# EAGLE design gen6.d (EAGLE 5.10)
PARTNO: *
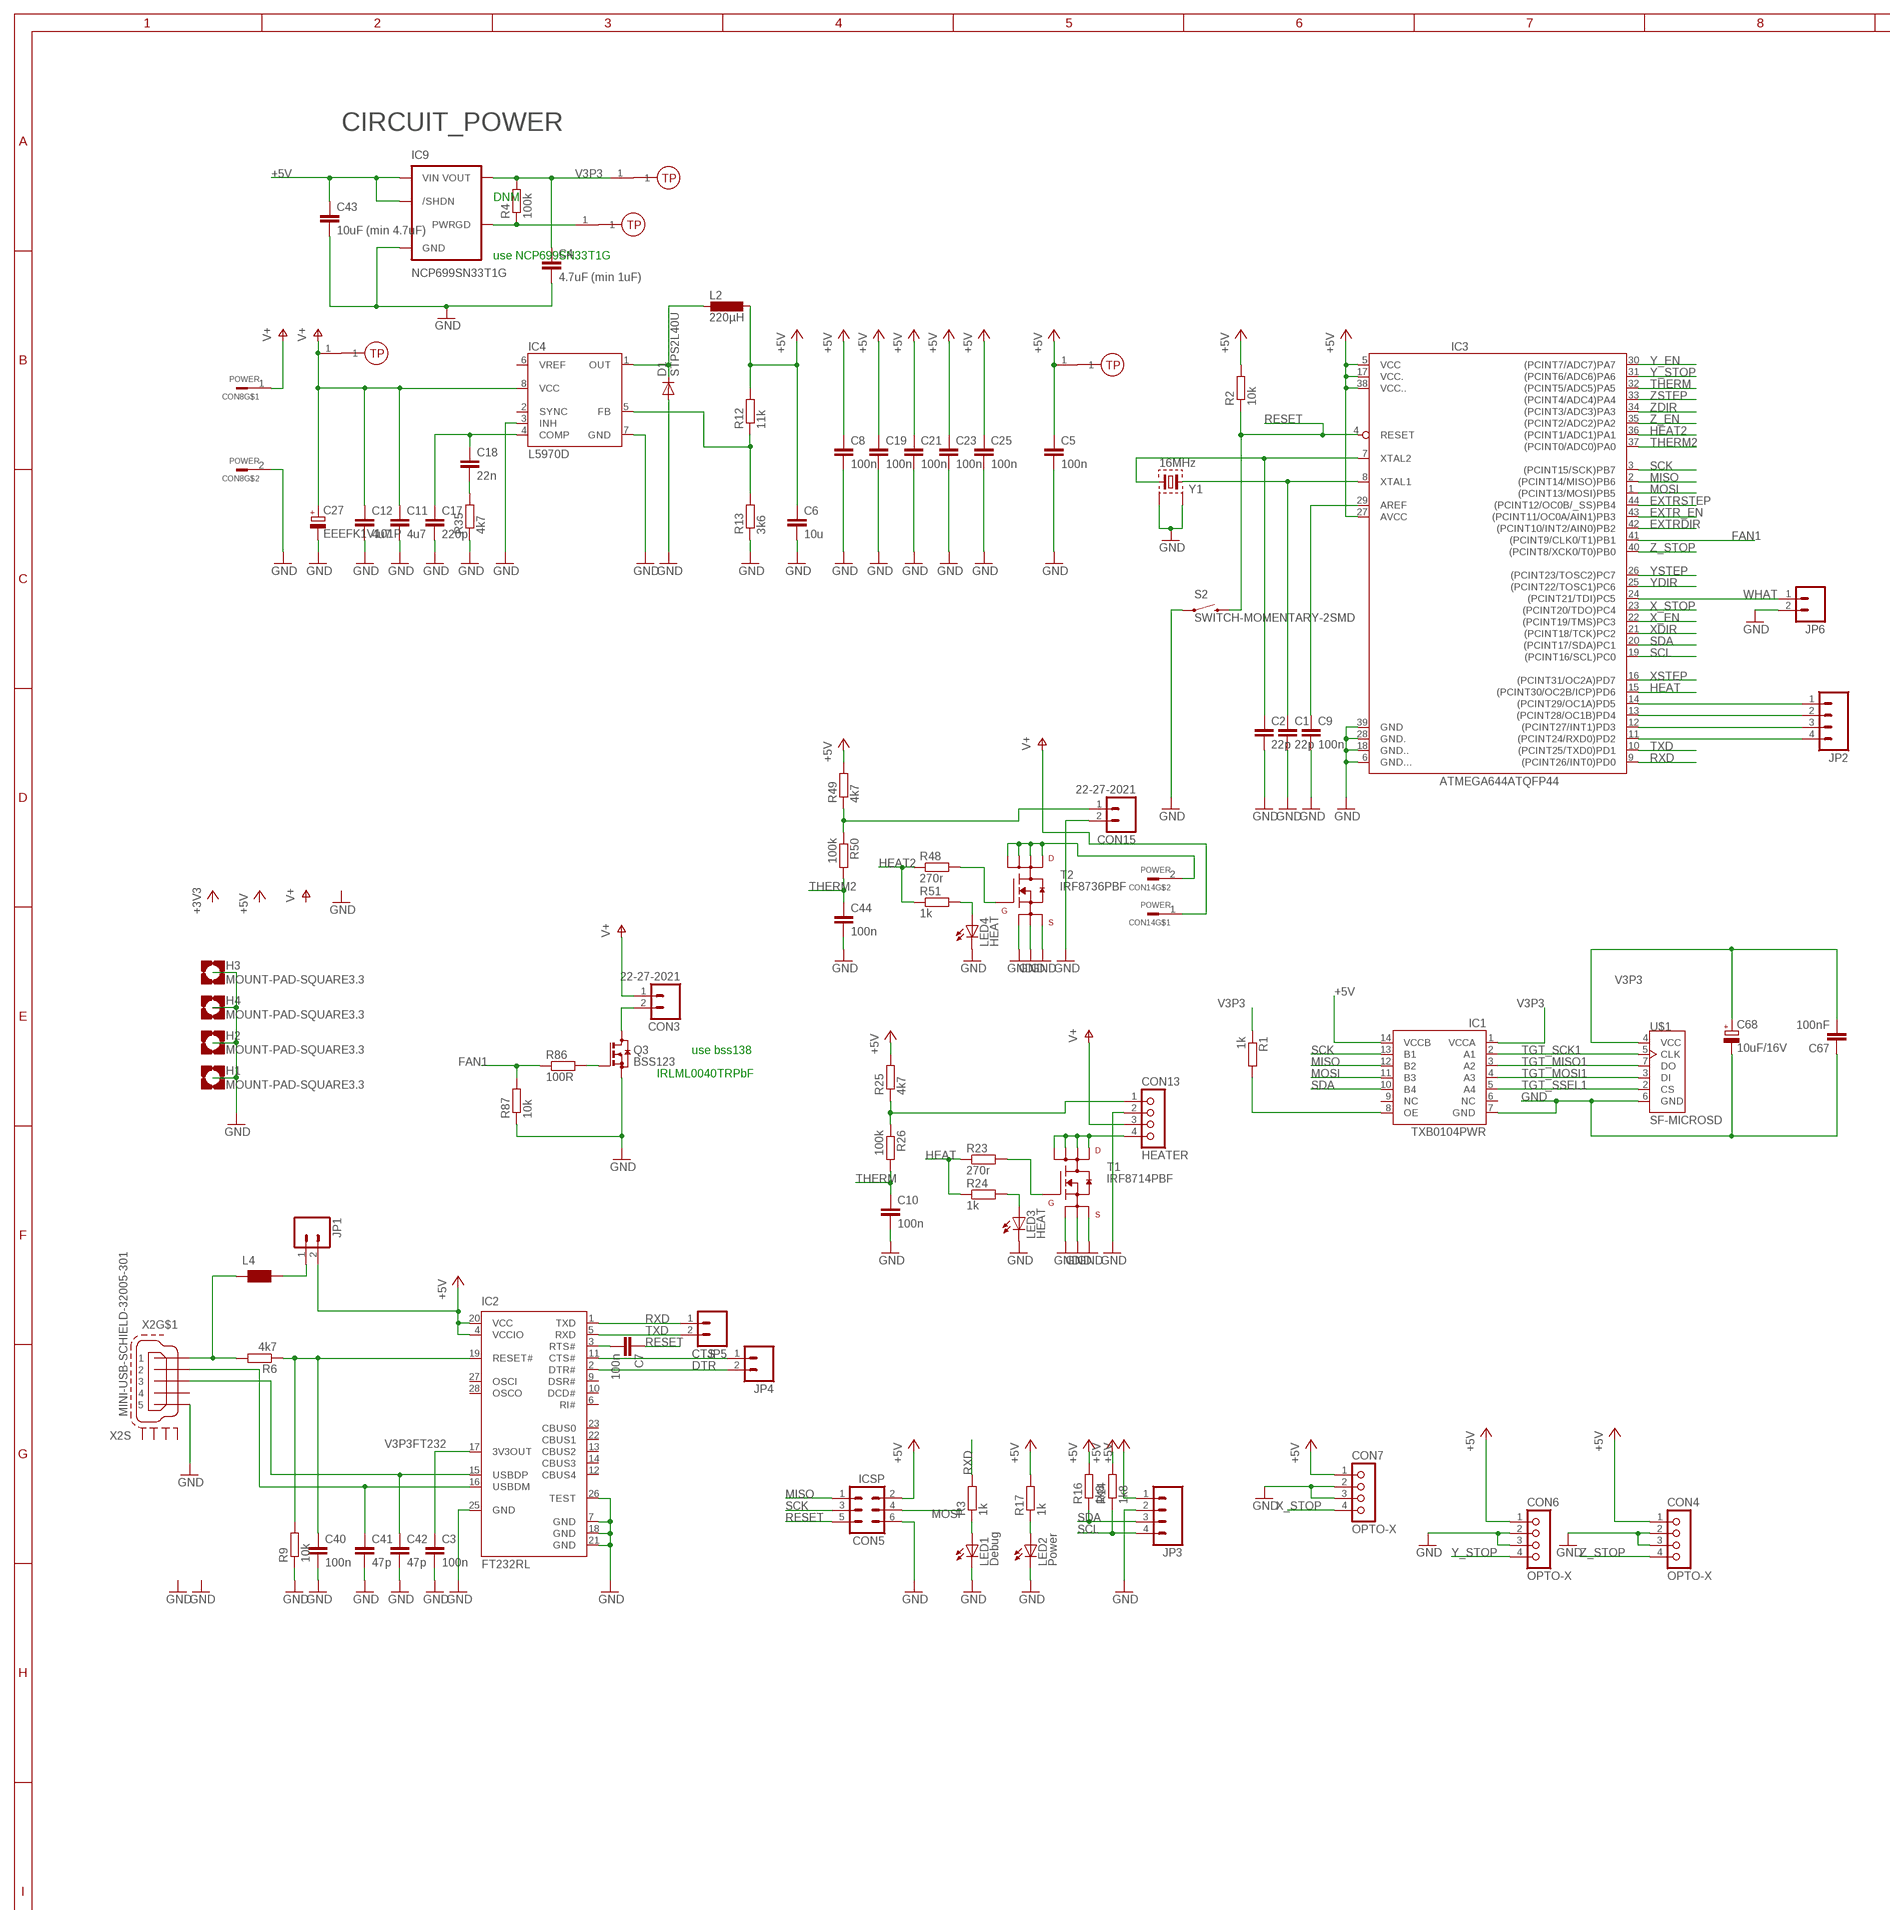
[diagram p0: schematic, sheet 1, part 1 of 2]
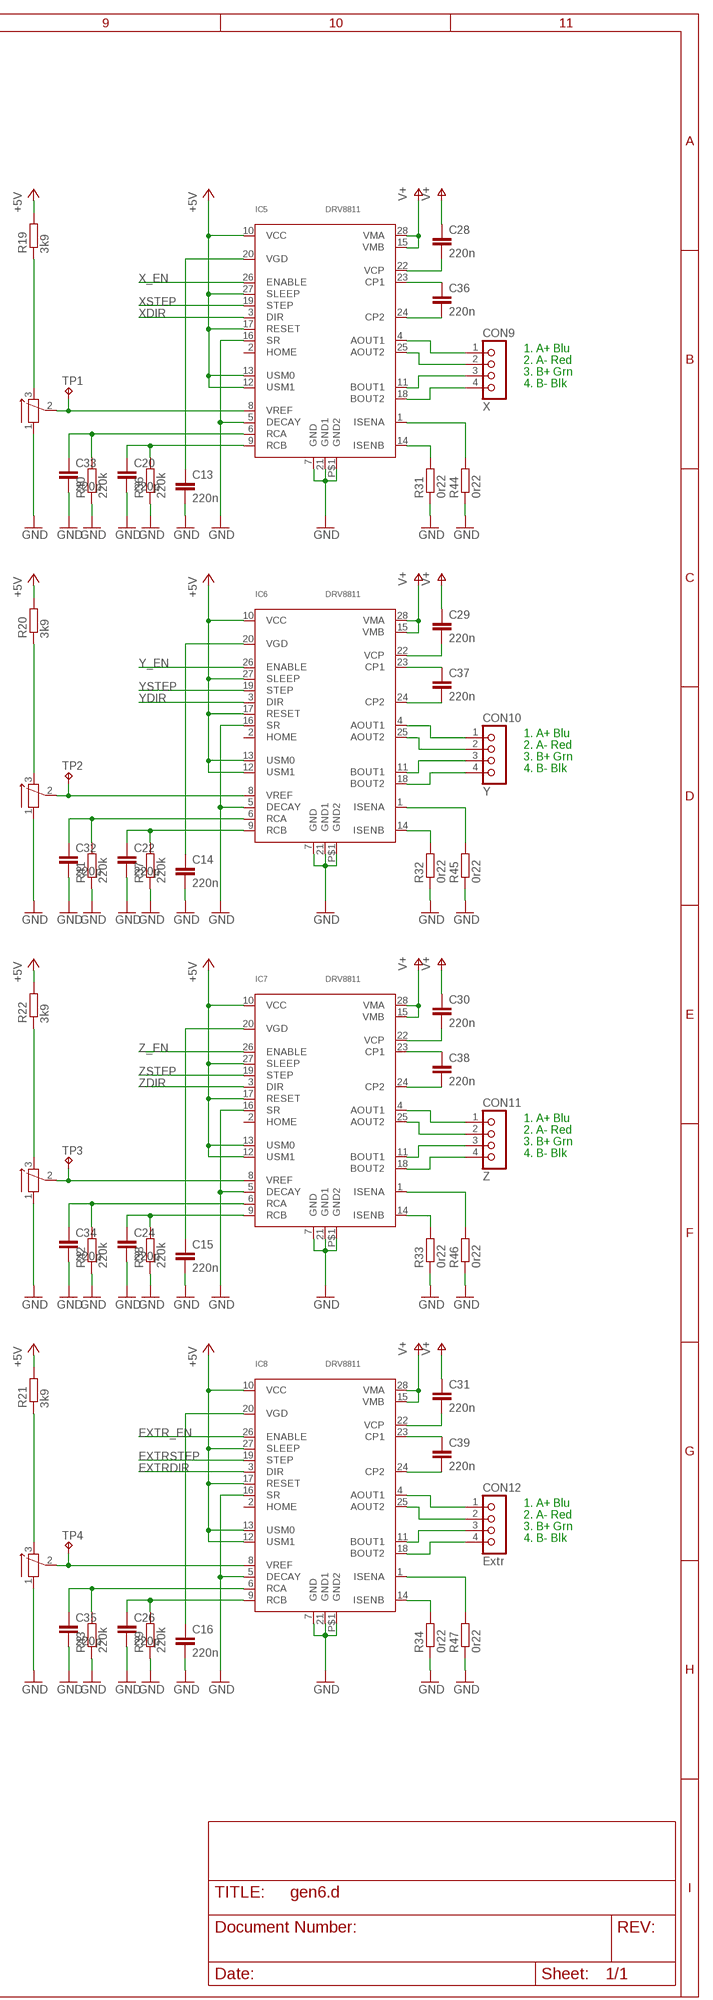
[diagram p1: schematic, sheet 1, part 2 of 2]

## Parts
C1  22p  C-EUC0603  [C0603]
C2  22p  C-EUC0603  [C0603]
C3  100n  C-EUC0603  [C0603]
C4  4.7uF (min 1uF)  C-EUC0805LG  [C0805_LONGER]
C5  100n  C-EUC0603  [C0603]
C6  10u  C-EUC1206  [C1206]
C7  100n  C-EUC0603  [C0603]
C8  100n  C-EUC0603  [C0603]
C9  100n  C-EUC0603  [C0603]
C10  100n  C-EUC0603  [C0603]
C11  4u7  C-EUC1206  [C1206]
C12  4u7  C-EUC1206  [C1206]
C13  220n  C-EUC1206  [C1206]
C14  220n  C-EUC1206  [C1206]
C15  220n  C-EUC1206  [C1206]
C16  220n  C-EUC1206  [C1206]
C17  220p  C-EUC0603  [C0603]
C18  22n  C-EUC0603  [C0603]
C19  100n  C-EUC0603  [C0603]
C20  220p  C-EUC0603  [C0603]
C21  100n  C-EUC0603  [C0603]
C22  220p  C-EUC0603  [C0603]
C23  100n  C-EUC0603  [C0603]
C24  220p  C-EUC0603  [C0603]
C25  100n  C-EUC0603  [C0603]
C26  220p  C-EUC0603  [C0603]
C27  EEEFK1V101P  CPOL-EUF  [PANASONIC_F]
C28  220n  C-EUC1206  [C1206]
C29  220n  C-EUC1206  [C1206]
C30  220n  C-EUC1206  [C1206]
C31  220n  C-EUC1206  [C1206]
C32  220p  C-EUC0603  [C0603]
C33  220p  C-EUC0603  [C0603]
C34  220p  C-EUC0603  [C0603]
C35  220p  C-EUC0603  [C0603]
C36  220n  C-EUC1206  [C1206]
C37  220n  C-EUC1206  [C1206]
C38  220n  C-EUC1206  [C1206]
C39  220n  C-EUC1206  [C1206]
C40  100n  C-EUC0603  [C0603]
C41  47p  C-EUC0603  [C0603]
C42  47p  C-EUC0603  [C0603]
C43  10uF (min 4.7uF)  C-EUC0805LG  [C0805_LONGER]
C44  100n  C-EUC0603  [C0603]
C67  100nF  C-EUC0603  [C0603]
C68  10uF/16V  CPOL-EUCT3216  [CT3216]
CON3  22-27-2021  M02POLAR  [MOLEX-1X2]
CON4  OPTO-X  61900411121  [61900411121]
CON5  ICSP  MA03-2  [MA03-2]
CON6  OPTO-X  61900411121  [61900411121]
CON7  OPTO-X  61900411121  [61900411121]
CON8  POWER  WEIDMULLERSL2  [WEIDMULLERSL2]
CON9  X  61900411121  [61900411121]
CON10  Y  61900411121  [61900411121]
CON11  Z  61900411121  [61900411121]
CON12  Extr  61900411121  [61900411121]
CON13  HEATER  61900411121  [61900411121]
CON14  POWER  WEIDMULLERSL2  [WEIDMULLERSL2]
CON15  22-27-2021  M02POLAR  [MOLEX-1X2]
D1  STPS2L40U  DIODE-SMB  [SMB]
H1  MOUNT-PAD-SQUARE3.3  [3,3-PAD-SQUARE]
H2  MOUNT-PAD-SQUARE3.3  [3,3-PAD-SQUARE]
H3  MOUNT-PAD-SQUARE3.3  [3,3-PAD-SQUARE]
H4  MOUNT-PAD-SQUARE3.3  [3,3-PAD-SQUARE]
IC1  TXB0104PWR  TXB104PWR  [TSSOP(PW)-14]
IC2  FT232RL  [SSOP28]
IC3  ATMEGA644ATQFP44  [TQFP44]
IC4  L5970D  [SO-08]
IC5  DRV8811  [HTSSOP28]
IC6  DRV8811  [HTSSOP28]
IC7  DRV8811  [HTSSOP28]
IC8  DRV8811  [HTSSOP28]
IC9  NCP699SN33T1G  MCP1824T-1802EOT  [SOT23-5]
JP1  M02PTH  [1X02]
JP2  M04PTH  [1X04]
JP3  M04PTH  [1X04]
JP4  M02PTH  [1X02]
JP5  M02PTH  [1X02]
JP6  M02PTH  [1X02]
L2  220µH  DO3316P  [DO3316P]
L4  WE-CBF_1210  [1210]
LED1  Debug  LEDCHIP-LED0805  [CHIP-LED0805]
LED2  Power  LEDCHIP-LED0805  [CHIP-LED0805]
LED3  HEAT  LEDCHIP-LED0805  [CHIP-LED0805]
LED4  HEAT  LEDCHIP-LED0805  [CHIP-LED0805]
Q3  BSS123  [SOT23]
R1  1k  R-EU_R0603  [R0603]
R2  10k  R-EU_R0603  [R0603]
R3  1k  R-EU_R0603  [R0603]
R4  100k  R-EU_R0603  [R0603]
R6  4k7  R-EU_R0603  [R0603]
R9  10k  R-EU_R0603  [R0603]
R12  11k  R-EU_R0603  [R0603]
R13  3k6  R-EU_R0603  [R0603]
R14  1k8  R-EU_R0603  [R0603]
R16  1k8  R-EU_R0603  [R0603]
R17  1k  R-EU_R0603  [R0603]
R19  3k9  R-EU_R0603  [R0603]
R20  3k9  R-EU_R0603  [R0603]
R21  3k9  R-EU_R0603  [R0603]
R22  3k9  R-EU_R0603  [R0603]
R23  270r  R-EU_R0603  [R0603]
R24  1k  R-EU_R0603  [R0603]
R25  4k7  R-EU_R0603  [R0603]
R26  100k  R-EU_R0603  [R0603]
R27  10k  3314G-1  [3314G-1]
R28  10k  3314G-1  [3314G-1]
R29  10k  3314G-1  [3314G-1]
R30  10k  3314G-1  [3314G-1]
R31  0r22  R-EU_R1210  [R1210]
R32  0r22  R-EU_R1210  [R1210]
R33  0r22  R-EU_R1210  [R1210]
R34  0r22  R-EU_R1210  [R1210]
R35  4k7  R-EU_R0603  [R0603]
R36  220k  R-EU_R0603  [R0603]
R37  220k  R-EU_R0603  [R0603]
R38  220k  R-EU_R0603  [R0603]
R39  220k  R-EU_R0603  [R0603]
R40  220k  R-EU_R0603  [R0603]
R41  220k  R-EU_R0603  [R0603]
R42  220k  R-EU_R0603  [R0603]
R43  220k  R-EU_R0603  [R0603]
R44  0r22  R-EU_R1210  [R1210]
R45  0r22  R-EU_R1210  [R1210]
R46  0r22  R-EU_R1210  [R1210]
R47  0r22  R-EU_R1210  [R1210]
R48  270r  R-EU_R0603  [R0603]
R49  4k7  R-EU_R0603  [R0603]
R50  100k  R-EU_R0603  [R0603]
R51  1k  R-EU_R0603  [R0603]
R86  100R  R-EU_R0603  [R0603]
R87  10k  R-EU_R0603  [R0603]
S2  SWITCH-MOMENTARY-2SMD  [TACTILE_SWITCH_SMD]
T1  IRF8714PBF  MOSFET_N_SO8  [SO-08]
T2  IRF8736PBF  MOSFET_N_SO8  [SO-08]
TP1  TPB1,27  [B1,27]
TP2  TPB1,27  [B1,27]
TP3  TPB1,27  [B1,27]
TP4  TPB1,27  [B1,27]
TP5  TP_1  [TP_1]
TP6  TP_1  [TP_1]
TP7  TP_1  [TP_1]
TP8  TP_1  [TP_1]
U$1  SF-MICROSD  [MICROSD]
X2  MINI-USB-SCHIELD-32005-301  [32005-301]
Y1  16MHz  ABM3B  [ABM3B]

## Nets
+5V: C5.1 C6.1 C8.1 C19.1 C21.1 C23.1 C25.1 C43.1 CON4.1 CON5.2 CON6.1 CON7.1 IC1.14(VCCB) IC2.4(VCCIO) IC2.20(VCC) IC3.5(VCC) IC3.17(VCC.) IC3.27(AVCC) IC3.38(VCC..) IC5.10(VCC) IC5.12(USM1) IC5.13(USM0) IC5.17(RESET) IC5.27(SLEEP) IC6.10(VCC) IC6.12(USM1) IC6.13(USM0) IC6.17(RESET) IC6.27(SLEEP) IC7.10(VCC) IC7.12(USM1) IC7.13(USM0) IC7.17(RESET) IC7.27(SLEEP) IC8.10(VCC) IC8.12(USM1) IC8.13(USM0) IC8.17(RESET) IC8.27(SLEEP) IC9.1(VIN) IC9.3(/SHDN) JP1.2 JP3.1 L2.2 R2.2 R12.2 R14.2 R16.2 R17.2 R19.2 R20.2 R21.2 R22.2 R25.2 R49.2 TP7.1
CTS: IC2.11(CTS#) JP4.1
DTR: IC2.2(DTR#) JP4.2
EXTR_EN: IC3.43((PCINT11/OC0A/AIN1)PB3) IC8.26(ENABLE)
EXTRDIR: IC3.42((PCINT10/INT2/AIN0)PB2) IC8.3(DIR)
EXTRSTEP: IC3.44((PCINT12/OC0B/_SS)PB4) IC8.19(STEP)
FAN1: IC3.41((PCINT9/CLK0/T1)PB1) R86.1 R87.2
GND: C1.2 C2.2 C3.2 C4.2 C5.2 C6.2 C8.2 C9.2 C10.2 C11.2 C12.2 C13.2 C14.2 C15.2 C16.2 C17.2 C19.2 C20.2 C21.2 C22.2 C23.2 C24.2 C25.2 C26.2 C27.- C32.2 C33.2 C34.2 C35.2 C40.2 C41.2 C42.2 C43.2 C44.2 C67.1 C68.- CON4.2 CON4.3 CON5.6 CON6.2 CON6.3 CON7.2 CON7.3 CON8.2 CON13.2 CON15.2 D1.A H1.B3,3(MOUNT) H2.B3,3(MOUNT) H3.B3,3(MOUNT) H4.B3,3(MOUNT) IC1.7(GND) IC2.7(GND) IC2.18(GND) IC2.21(GND) IC2.25(GND) IC2.26(TEST) IC3.6(GND...) IC3.18(GND..) IC3.28(GND.) IC3.39(GND) IC4.3(INH) IC4.7(GND) IC5.5(DECAY) IC5.7(GND) IC5.16(SR) IC5.21(GND1) IC5.P$1(GND2) IC6.5(DECAY) IC6.7(GND) IC6.16(SR) IC6.21(GND1) IC6.P$1(GND2) IC7.5(DECAY) IC7.7(GND) IC7.16(SR) IC7.21(GND1) IC7.P$1(GND2) IC8.5(DECAY) IC8.7(GND) IC8.16(SR) IC8.21(GND1) IC8.P$1(GND2) IC9.2(GND) JP3.2 JP6.2 LED1.C LED2.C LED3.C LED4.C Q3.2(S) R9.1 R13.1 R27.1 R28.1 R29.1 R30.1 R31.1 R32.1 R33.1 R34.1 R35.1 R36.1 R37.1 R38.1 R39.1 R40.1 R41.1 R42.1 R43.1 R44.1 R45.1 R46.1 R47.1 R87.1 S2.1 T1.1(S1) T1.2(S2) T1.3(S3) T2.1(S1) T2.2(S2) T2.3(S3) U$1.6(GND) X2.5 Y1.2 Y1.4
HEAT: IC3.15((PCINT30/OC2B/ICP)PD6) R23.1 R24.1
HEAT2: IC3.36((PCINT1/ADC1)PA1) R48.1 R51.1
MISO: CON5.1 IC1.12(B2) IC3.2((PCINT14/MISO)PB6)
MOSI: CON5.4 IC1.11(B3) IC3.1((PCINT13/MOSI)PB5)
N$1: C36.2 IC5.24(CP2)
N$2: IC5.14(ISENB) R31.2
N$3: IC5.1(ISENA) R44.2
N$4: C36.1 IC5.23(CP1)
N$5: C28.2 IC5.22(VCP)
N$6: IC3.14((PCINT29/OC1A)PD5) JP2.1
N$7: C7.2 IC2.3(RTS#)
N$8: C13.1 IC5.20(VGD)
N$9: C20.1 IC5.9(RCB) R36.2
N$10: C33.1 IC5.6(RCA) R40.2
N$11: R19.1 R27.3
N$12: CON9.1 IC5.4(AOUT1)
N$13: IC5.8(VREF) R27.2 TP1.PP(TP)
N$14: IC3.13((PCINT28/OC1B)PD4) JP2.2
N$15: CON14.2 T2.5(D1) T2.6(D2) T2.7(D3) T2.8(D4)
N$16: CON9.2 IC5.25(AOUT2)
N$17: CON9.3 IC5.11(BOUT1)
N$18: CON9.4 IC5.18(BOUT2)
N$19: LED1.A R3.1
N$20: LED2.A R17.1
N$21: LED3.A R24.2
N$22: IC6.14(ISENB) R32.2
N$23: IC6.1(ISENA) R45.2
N$24: C37.2 IC6.24(CP2)
N$25: C37.1 IC6.23(CP1)
N$26: C29.2 IC6.22(VCP)
N$27: C14.1 IC6.20(VGD)
N$28: C22.1 IC6.9(RCB) R37.2
N$29: C32.1 IC6.6(RCA) R41.2
N$30: C9.1 IC3.29(AREF)
N$31: R20.1 R28.3
N$32: IC6.8(VREF) R28.2 TP2.PP(TP)
N$33: R48.2 T2.4(G)
N$34: CON15.1 R49.1 R50.1
N$35: LED4.A R51.2
N$36: CON10.1 IC6.4(AOUT1)
N$37: CON10.2 IC6.25(AOUT2)
N$38: CON10.3 IC6.11(BOUT1)
N$39: CON10.4 IC6.18(BOUT2)
N$40: IC3.12((PCINT27/INT1)PD3) JP2.3
N$41: IC3.11((PCINT24/RXD0)PD2) JP2.4
N$42: JP1.1 L4.2
N$43: IC7.14(ISENB) R33.2
N$44: IC7.1(ISENA) R46.2
N$45: C38.2 IC7.24(CP2)
N$46: C38.1 IC7.23(CP1)
N$47: C30.2 IC7.22(VCP)
N$48: C15.1 IC7.20(VGD)
N$49: C24.1 IC7.9(RCB) R38.2
N$50: C34.1 IC7.6(RCA) R42.2
N$52: R22.1 R29.3
N$53: IC7.8(VREF) R29.2 TP3.PP(TP)
N$56: IC1.8(OE) R1.2
N$57: CON11.1 IC7.4(AOUT1)
N$58: CON11.2 IC7.25(AOUT2)
N$59: CON11.3 IC7.11(BOUT1)
N$60: CON11.4 IC7.18(BOUT2)
N$61: IC9.4(PWRGD) R4.1 TP5.1
N$64: IC8.14(ISENB) R34.2
N$65: IC8.1(ISENA) R47.2
N$66: C39.2 IC8.24(CP2)
N$67: C39.1 IC8.23(CP1)
N$68: C31.2 IC8.22(VCP)
N$69: C16.1 IC8.20(VGD)
N$70: C26.1 IC8.9(RCB) R39.2
N$71: C35.1 IC8.6(RCA) R43.2
N$73: R21.1 R30.3
N$74: IC8.8(VREF) R30.2 TP4.PP(TP)
N$78: CON12.1 IC8.4(AOUT1)
N$79: CON12.2 IC8.25(AOUT2)
N$80: CON12.3 IC8.11(BOUT1)
N$81: CON12.4 IC8.18(BOUT2)
N$91: C18.2 R35.2
N$92: C17.1 C18.1 IC4.4(COMP)
N$93: IC4.5(FB) R12.1 R13.2
N$94: D1.C IC4.1(OUT) L2.1
N$95: CON13.4 T1.5(D1) T1.6(D2) T1.7(D3) T1.8(D4)
N$96: R23.2 T1.4(G)
N$98: CON13.1 R25.1 R26.1
N$100: L4.1 R6.2 X2.1
N$105: C41.1 IC2.16(USBDM) X2.2
N$106: C42.1 IC2.15(USBDP) X2.3
N$107: C40.1 IC2.19(RESET#) R6.1 R9.2
N$110: C1.1 IC3.8(XTAL1) Y1.3
N$111: C2.1 IC3.7(XTAL2) Y1.1
N$117: Q3.1(G) R86.2
N$118: CON3.2 Q3.3(D)
RESET: C7.1 CON5.5 IC3.4(RESET) R2.1 S2.3
RXD: IC2.1(TXD) IC3.9((PCINT26/INT0)PD0) JP5.1 R3.2
SCK: CON5.3 IC1.13(B1) IC3.3((PCINT15/SCK)PB7)
SCL: IC3.19((PCINT16/SCL)PC0) JP3.4 R14.1
SDA: IC1.10(B4) IC3.20((PCINT17/SDA)PC1) JP3.3 R16.1
TGT_MISO1: IC1.3(A2) U$1.7(DO)
TGT_MOSI1: IC1.4(A3) U$1.3(DI)
TGT_SCK1: IC1.2(A1) U$1.5(CLK)
TGT_SSEL1: IC1.5(A4) U$1.2(CS)
THERM: C10.1 IC3.32((PCINT5/ADC5)PA5) R26.2
THERM2: C44.1 IC3.37((PCINT0/ADC0)PA0) R50.2
TXD: IC2.5(RXD) IC3.10((PCINT25/TXD0)PD1) JP5.2
V3P3: C4.1 C67.2 C68.+ IC1.1(VCCA) IC9.5(VOUT) R1.1 R4.2 TP6.1 U$1.4(VCC)
V3P3FT232: C3.1 IC2.17(3V3OUT)
V+: C11.1 C12.1 C27.+ C28.1 C29.1 C30.1 C31.1 CON3.1 CON8.1 CON13.3 CON14.1 IC4.8(VCC) IC5.15(VMB) IC5.28(VMA) IC6.15(VMB) IC6.28(VMA) IC7.15(VMB) IC7.28(VMA) IC8.15(VMB) IC8.28(VMA) TP8.1
WHAT: IC3.24((PCINT21/TDI)PC5) JP6.1
X_EN: IC3.22((PCINT19/TMS)PC3) IC5.26(ENABLE)
X_STOP: CON7.4 IC3.23((PCINT20/TDO)PC4)
XDIR: IC3.21((PCINT18/TCK)PC2) IC5.3(DIR)
XSTEP: IC3.16((PCINT31/OC2A)PD7) IC5.19(STEP)
Y_EN: IC3.30((PCINT7/ADC7)PA7) IC6.26(ENABLE)
Y_STOP: CON6.4 IC3.31((PCINT6/ADC6)PA6)
YDIR: IC3.25((PCINT22/TOSC1)PC6) IC6.3(DIR)
YSTEP: IC3.26((PCINT23/TOSC2)PC7) IC6.19(STEP)
Z_EN: IC3.35((PCINT2/ADC2)PA2) IC7.26(ENABLE)
Z_STOP: CON4.4 IC3.40((PCINT8/XCK0/T0)PB0)
ZDIR: IC3.34((PCINT3/ADC3)PA3) IC7.3(DIR)
ZSTEP: IC3.33((PCINT4/ADC4)PA4) IC7.19(STEP)
Unconnected: IC1.6(NC) IC1.9(NC) IC2.6(RI#) IC2.9(DSR#) IC2.10(DCD#) IC2.12(CBUS4) IC2.13(CBUS2) IC2.14(CBUS3) IC2.22(CBUS1) IC2.23(CBUS0) IC2.27(OSCI) IC2.28(OSCO) IC4.2(SYNC) IC4.6(VREF) IC5.2(HOME) IC6.2(HOME) IC7.2(HOME) IC8.2(HOME) X2.4 X2.M1(S:S1) X2.M2(S:S2) X2.M3(S:S3) X2.M4(S:S4)

## Notes on the sheet
- CIRCUIT_POWER
- DNM
- use NCP699SN33T1G
- 1. A+ Blu
- 2. A- Red
- 3. B+ Grn
- 4. B- Blk
- 1. A+ Blu
- 2. A- Red
- 3. B+ Grn
- 4. B- Blk
- use bss138
- IRLML0040TRPbF
- 1. A+ Blu
- 2. A- Red
- 3. B+ Grn
- 4. B- Blk
- 1. A+ Blu
- 2. A- Red
- 3. B+ Grn
- 4. B- Blk

## Library data of the parts
C1-C3 C5-C26 C28-C42 C44 = rcl:C-EU: CAPACITOR, European symbol
C4 C43 = beagleboard1x:C-EU: CAPACITOR, European symbol
C27 = rcl:CPOL-EU: POLARIZED CAPACITOR, European symbol
C67 = cubicstomp1:C-EU: CAPACITOR, European symbol
C68 = cubicstomp1:CPOL-EU: POLARIZED CAPACITOR, European symbol
CON3 CON15 = romscraj:M02: Header 2 Standard 2-pin 0.1" header. Use with straight break away headers (SKU : PRT-00116), right angle break away headers (PRT-00553), swiss pins (PRT-00743), machine pins (PRT-00117), and female headers (PRT-00115). Molex polarized connector foot print use with SKU : PRT-08233 with associated crimp pins and housings.
CON4 CON6 CON7 CON9-CON13 = Wurth-WR-WTB:61900411121
CON5 = con-lstb:MA03-2: PIN HEADER
CON8 CON14 = eje-components:WEIDMULLERSL2
D1 = diode:DIODE-: DIODE
H1-H4 = holes:MOUNT-PAD-SQUARE: MOUNTING PAD, square
IC1 = ti_txb0104:TXB104
IC2 = ftdichip:FT232R: Source: http://www.ftdichip.com/Documents/DataSheets/DS_FT232R_v104.pdf
IC3 = eje-components:ATMEGA644A
IC4 = eje-components:L5970D
IC5-IC8 = eje-components:DRV8811
IC9 = beagleboard1x:MCP1824T-1802E
JP1 JP4-JP6 = SparkFun:M02: Header 2 Standard 2-pin 0.1" header. Use with straight break away headers (SKU : PRT-00116), right angle break away headers (PRT-00553), swiss pins (PRT-00743), machine pins (PRT-00117), and female headers (PRT-00115). Molex polarized connector foot print use with SKU : PRT-08233 with associated crimp pins and housings.
JP2 JP3 = SparkFun:M04: Header 4 Standard 4-pin 0.1" header. Use with straight break away headers (SKU : PRT-00116), right angle break away headers (PRT-00553), swiss pins (PRT-00743), machine pins (PRT-00117), and female headers (PRT-00115). Molex polarized connector foot print use with SKU : PRT-08231 with associated crimp pins and housings. 1MM SMD Version SKU: PRT-10208
L2 = inductor-coilcraft:DO3316P: COILCRAFT
L4 = wuerth-elektronik:WE-CBF: SMD EMI Suppression Ferrite Beads - excellent anti-EMI properties - low DCR - impedances till 3000 ohms - rated current up to 6 A
LED1-LED4 = led:LED: LED OSRAM: - CHIPLED LG R971, LG N971, LY N971, LG Q971, LY Q971, LO R971, LY R971 LH N974, LH R974 LS Q976, LO Q976, LY Q976 LO Q996 - Hyper CHIPLED LW Q18S LB Q993, LB Q99A, LB R99A - SideLED LS A670, LO A670, LY A670, LG A670, LP A670 LB A673, LV A673, LT A673, LW A673 LH A674 LY A675 LS A676, LA A676, LO A676, LY A676, LW A676 LS A679, LY A679, LG A679 - Hyper Micro SIDELED® LS Y876, LA Y876, LO Y876, LY Y876 LT Y87S - SmartLED LW L88C, LW L88S LB L89C, LB L89S, LG L890 LS L89K, LO L89K, LY L89K LS L896, LA L896, LO L896, LY L896 - TOPLED LS T670, LO T670, LY T670, LG T670, LP T670 LSG T670, LSP T670, LSY T670, LOP T670, LYG T670 LG T671, LOG T671, LSG T671 LB T673, LV T673, LT T673, LW T673 LH T674 LS T676, LA T676, LO T676, LY T676, LB T676, LH T676, LSB T676, LW T676 LB T67C, LV T67C, LT T67C, LS T67K, LO T67K, LY T67K, LW E67C LS E67B, LA E67B, LO E67B, LY E67B, LB E67C, LV E67C, LT E67C LW T67C LS T679, LY T679, LG T679 LS T770, LO T770, LY T770, LG T770, LP T770 LB T773, LV T773, LT T773, LW T773 LH T774 LS E675, LA E675, LY E675, LS T675 LS T776, LA T776, LO T776, LY T776, LB T776 LHGB T686 LT T68C, LB T68C - Hyper Mini TOPLED® LB M676 - Mini TOPLED Santana® LG M470 LS M47K, LO M47K, LY M47K Source: http://www.osram.convergy.de - LUMILED® LXK2-PW12-R00, LXK2-PW12-S00, LXK2-PW14-U00, LXK2-PW14-V00 LXK2-PM12-R00, LXK2-PM12-S00, LXK2-PM14-U00 LXK2-PE12-Q00, LXK2-PE12-R00, LXK2-PE12-S00, LXK2-PE14-T00, LXK2-PE14-U00 LXK2-PB12-K00, LXK2-PB12-L00, LXK2-PB12-M00, LXK2-PB14-N00, LXK2-PB14-P00, LXK2-PB14-Q00 LXK2-PR12-L00, LXK2-PR12-M00, LXK2-PR14-Q00, LXK2-PR14-R00 LXK2-PD12-Q00, LXK2-PD12-R00, LXK2-PD12-S00 LXK2-PH12-R00, LXK2-PH12-S00 LXK2-PL12-P00, LXK2-PL12-Q00, LXK2-PL12-R00 Source: www.luxeon.com
Q3 = transistor-small-signal:BSS123: N-CHANNEL MOS FET
R1-R3 R6 R9 R12-R14 R16 R17 R19-R26 R31-R51 R86 R87 = rcl:R-EU_: RESISTOR, European symbol
R4 = beagleboard1x:R-EU_: RESISTOR, European symbol
R27-R30 = eje-components:3314G-1
S2 = SparkFun:SWITCH-MOMENTARY-2
T1 T2 = eje-components:MOSFET_N_SO8
TP1-TP4 = testpad:TP
TP5-TP8 = beagleboard1x:TP_1
U$1 = microsd:SF-MICROSD
X2 = con-cypressindustries:MINI-USB-SCHIELD-: MINI USB-B Conector Source: www.cypressindustries.com
Y1 = crystal:ABM3B: CRYSTAL - ABRACON ABM3B Series, 5.0 x 3.2 mm

## Board
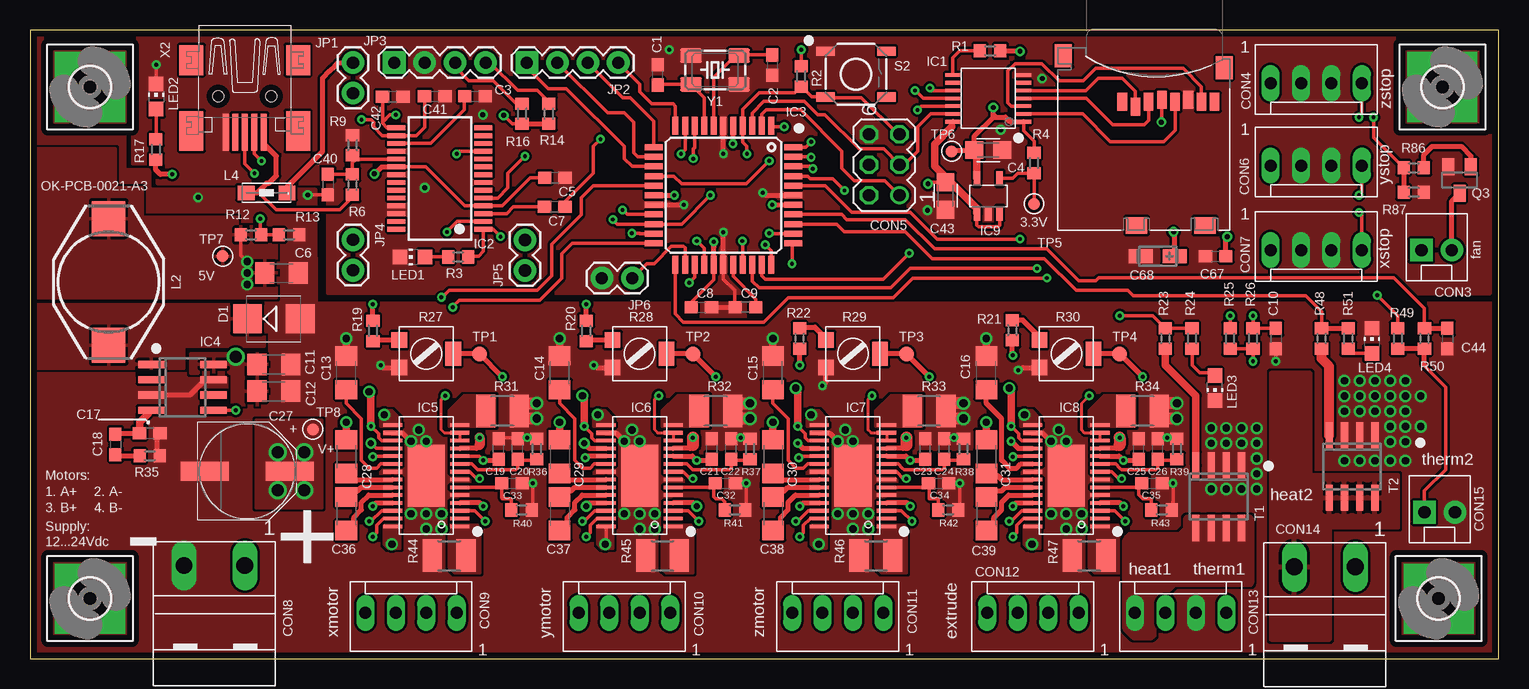
[diagram p2: board, top side]
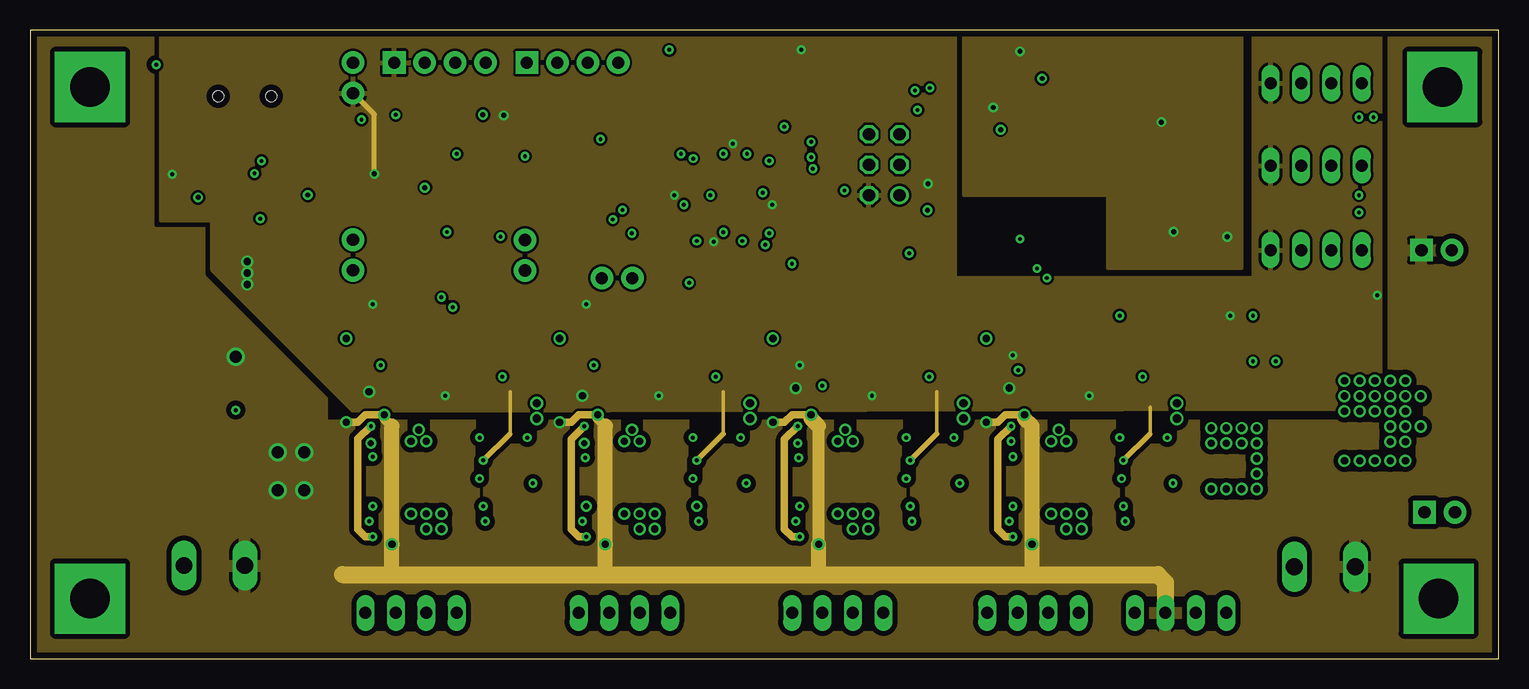
[diagram p3: board, inner layer supply]
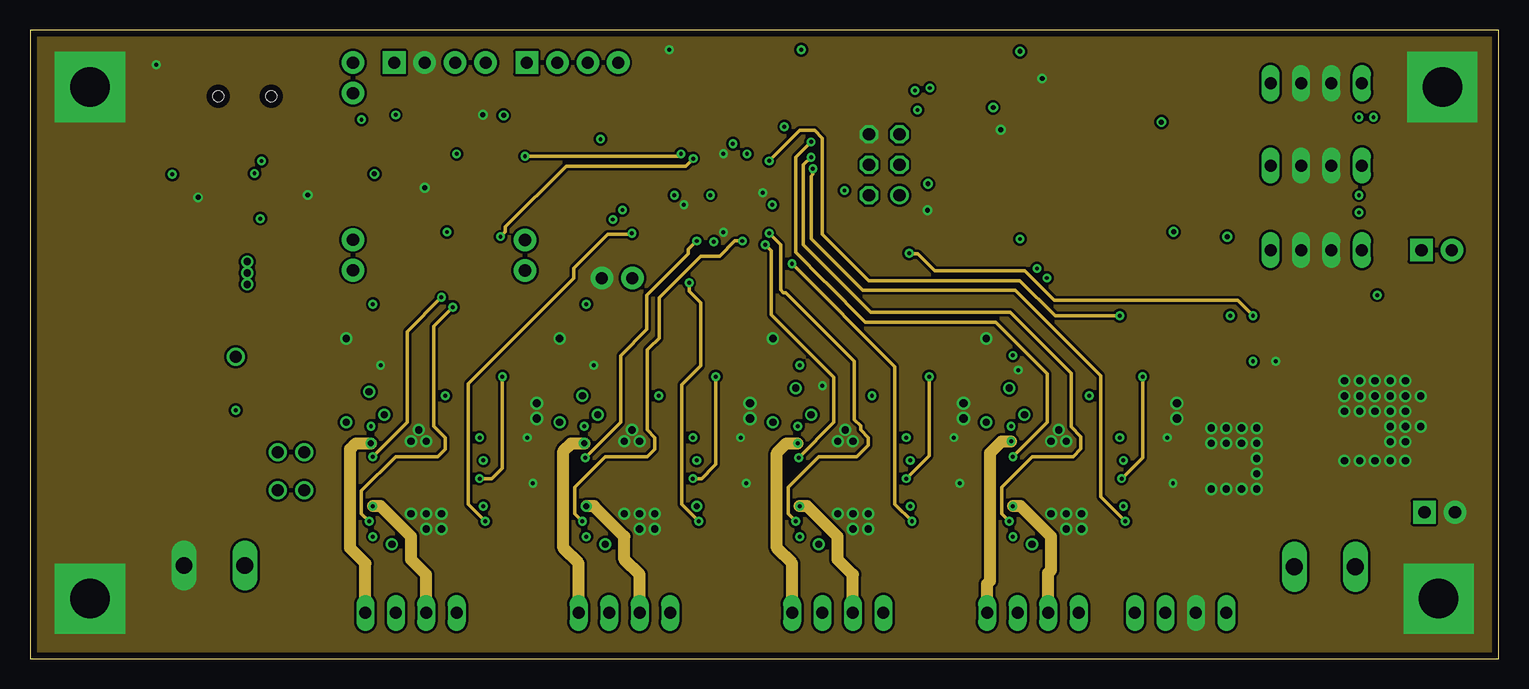
[diagram p4: board, inner layer Inner 2]
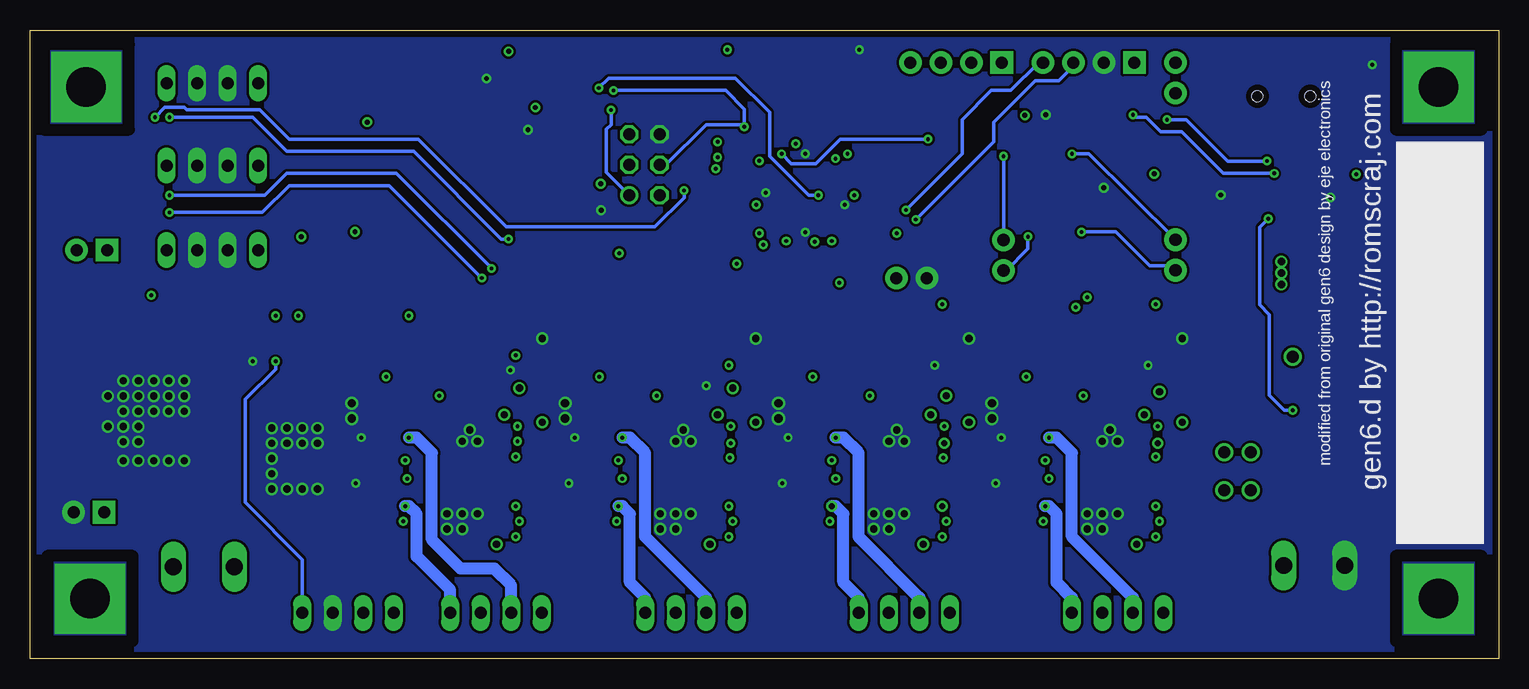
[diagram p5: board, bottom side, seen from below]

Size 122.38 x 52.38 mm. Coordinates in mm from the lower left corner, seen from the top.
Outline: 0,0 122.38,0 122.38,52.38 0,52.38 0,0
Copper layers (1+2*15+16): Top 0.018mm / dielectric 0.2mm / supply 0.035mm / dielectric 1.15mm / Inner 2 0.035mm / dielectric 0.2mm / Bottom 0.018mm
Design rules "ec-standardpool *": minimum track width 8mil, minimum drill 13mil, track to track 8mil, track to pad 8mil, pad to pad 8mil, via to via 8mil, smd to smd 8mil, copper to edge 0.5mm, drill to drill 8mil, minimum pad ring 10mil, minimum via ring 8mil, stop-mask expansion 2mil, vias tented up to drill 0mil, thermal gap 10mil
tKeepout: area -6.3,5.9 to -1.3,45.9; area 123.1,7.4 to 128.1,47.4
bKeepout: area 0,10 to 5,50; area 105,10 to 110,50

### Footprints (pad centres in the part's own frame; a part is rotated, then mirrored left to right if it is on the bottom)
C0603 = smd 1.1 x 1: 1 -0.85,0; 2 0.85,0
C0805_LONGER = smd 1.5 x 1.45: 1 -1.15,0; 2 1.15,0
C1206 = smd 1.6 x 1.8: 1 -1.4,0; 2 1.4,0
PANASONIC_F = smd 4 x 1.6: + 3.55,0; - -3.55,0
CT3216 = smd 2 x 1.2: + -1.4,0; - 1.4,0
MOLEX-1X2 = drill 1.016 pad 1.88 square: 1 0,0 | drill 1.016 pad 1.88 round: 2 2.54,0
61900411121 = drill 1 long: 1 3.81,0; 2 1.27,0; 3 -1.27,0; 4 -3.81,0
MA03-2 = drill 1.016 round: 1 -2.54,-1.27 | drill 1.016 octagon: 2 -2.54,1.27; 3 0,-1.27; 4 0,1.27; 5 2.54,-1.27; 6 2.54,1.27
WEIDMULLERSL2 = drill 1.4 long: 1 2.54,0; 2 7.62,0
SMB = smd 2.4 x 2.4: A 2.2,0; C -2.2,0
3,3-PAD-SQUARE = drill 3.3 pad 5.842 square: B3,3 0,0
TSSOP(PW)-14 = smd 0.3 x 1.25: 1 -1.95,-2.95; 2 -1.3,-2.95; 3 -0.65,-2.95; 4 0,-2.95; 5 0.65,-2.95; 6 1.3,-2.95; 7 1.95,-2.95; 8 1.95,2.95; 9 1.3,2.95; 10 0.65,2.95; 11 0,2.95; 12 -0.65,2.95; 13 -1.3,2.95; 14 -1.95,2.95
SSOP28 = smd 0.4 x 1.5: 1 -4.225,-3.625; 2 -3.575,-3.625; 3 -2.925,-3.625; 4 -2.275,-3.625; 5 -1.625,-3.625; 6 -0.975,-3.625; 7 -0.325,-3.625; 8 0.325,-3.625; 9 0.975,-3.625; 10 1.625,-3.625; 11 2.275,-3.625; 12 2.925,-3.625; 13 3.575,-3.625; 14 4.225,-3.625; 15 4.225,3.625; 16 3.575,3.625; 17 2.925,3.625; 18 2.275,3.625; 19 1.625,3.625; 20 0.975,3.625; 21 0.325,3.625; 22 -0.325,3.625; 23 -0.975,3.625; 24 -1.625,3.625; 25 -2.275,3.625; 26 -2.925,3.625; 27 -3.575,3.625; 28 -4.225,3.625
TQFP44 = smd 1.5 x 0.5: 1 -5.8,4; 2 -5.8,3.2; 3 -5.8,2.4; 4 -5.8,1.6; 5 -5.8,0.8; 6 -5.8,0; 7 -5.8,-0.8; 8 -5.8,-1.6; 9 -5.8,-2.4; 10 -5.8,-3.2; 11 -5.8,-4; 23 5.8,-4; 24 5.8,-3.2; 25 5.8,-2.4; 26 5.8,-1.6; 27 5.8,-0.8; 28 5.8,0; 29 5.8,0.8; 30 5.8,1.6; 31 5.8,2.4; 32 5.8,3.2; 33 5.8,4 | smd 0.5 x 1.5: 12 -4,-5.8; 13 -3.2,-5.8; 14 -2.4,-5.8; 15 -1.6,-5.8; 16 -0.8,-5.8; 17 0,-5.8; 18 0.8,-5.8; 19 1.6,-5.8; 20 2.4,-5.8; 21 3.2,-5.8; 22 4,-5.8; 34 4,5.8; 35 3.2,5.8; 36 2.4,5.8; 37 1.6,5.8; 38 0.8,5.8; 39 0,5.8; 40 -0.8,5.8; 41 -1.6,5.8; 42 -2.4,5.8; 43 -3.2,5.8; 44 -4,5.8
SO-08 = smd 0.6 x 2.2: 1 -1.905,-2.6; 2 -0.635,-2.6; 3 0.635,-2.6; 4 1.905,-2.6; 5 1.905,2.6; 6 0.635,2.6; 7 -0.635,2.6; 8 -1.905,2.6
HTSSOP28 = smd 0.3 x 1.6: 1 -4.225,-2.8; 2 -3.575,-2.8; 3 -2.925,-2.8; 4 -2.275,-2.8; 5 -1.625,-2.8; 6 -0.975,-2.8; 7 -0.325,-2.8; 8 0.325,-2.8; 9 0.975,-2.8; 10 1.625,-2.8; 11 2.275,-2.8; 12 2.925,-2.8; 13 3.575,-2.8; 14 4.225,-2.8; 15 4.225,2.8; 16 3.575,2.8; 17 2.925,2.8; 18 2.275,2.8; 19 1.625,2.8; 20 0.975,2.8; 21 0.325,2.8; 22 -0.325,2.8; 23 -0.975,2.8; 24 -1.625,2.8; 25 -2.275,2.8; 26 -2.925,2.8; 27 -3.575,2.8; 28 -4.225,2.8 | smd 5.18 x 3.1: P$1 0,0
SOT23-5 = smd 0.55 x 1.2: 1 -0.95,-1.46; 2 0,-1.46; 3 0.95,-1.46; 4 0.95,1.46; 5 -0.95,1.46
1X02 = drill 1.016 pad 1.88 round: 1 0,0; 2 2.54,0
1X04 = drill 1.016 pad 1.88 square: 1 0,0 | drill 1.016 pad 1.88 round: 2 2.54,0; 3 5.08,0; 4 7.62,0
DO3316P = smd 2.92 x 2.79: 1 -5.28,0; 2 5.28,0
1210 = smd 1.4 x 1.2: 1 -1.7,0; 2 1.7,0
CHIP-LED0805 = smd 1.2 x 1.2: A 0,-1.05; C 0,1.05
SOT23 = smd 1 x 1.4: 1 -0.95,-1.1; 2 0.95,-1.1; 3 0,1.1
R0603 = smd 1 x 1.1: 1 -0.85,0; 2 0.85,0
3314G-1 = smd 1.3 x 1.3: 1 -1.15,2.25; 3 1.15,2.25 | smd 2 x 1.3: 2 0,-2.25
R1210 = smd 1.6 x 2.7: 1 -1.4,0; 2 1.4,0
TACTILE_SWITCH_SMD = smd 1.524 x 0.762: 1 -2.54,1.905; 2 2.54,1.905; 3 -2.54,-1.905; 4 2.54,-1.905
B1,27 = smd 1.27 x 1.27: PP 0,0
TP_1 = smd 1 x 1: 1 0,0
MICROSD = smd 0.8 x 1.5: 1 -1.94,2.7; 2 -0.84,2.3; 3 0.26,2.7; 4 1.36,2.9; 5 2.46,2.7; 6 3.56,2.9; 7 4.66,2.7; 8 5.76,2.7 | smd 1.4 x 1.9: NC -6.85,6.55; NC3 6.55,5.55 | smd 1.8 x 1.4: NC1 -0.75,-7.6; NC2 4.95,-7.6
32005-301 = smd 3.1 x 0.5: 1 3,1.6; 2 3,0.8; 3 3,0; 4 3,-0.8; 5 3,-1.6 | smd 2.5 x 2: M1 -3,-4.45; M2 -3,4.45 | smd 3.3 x 2: M3 2.9,4.45; M4 2.9,-4.45 | hole 0.9: 0,2.2; 0,-2.2
ABM3B = smd 1.8 x 1.2: 1 -2,-1.2; 2 2,-1.2; 3 2,1.2; 4 -2,1.2

### Placement (x,y rotation side)
C1  52.32,48.64 90 top
C2  61.85,49.45 270 top
C3  37.08,46.85 0 top
C4  79.86,42.37 0 top
C5  43.74,40.08 0 top
C6  20.95,32.13 0 top
C7  43.73,37.63 180 top
C8  55.94,29.27 0 top
C9  59.63,29.27 180 top
C10  103.82,26.67 270 top
C11  20.32,24.51 0 top
C12  20.32,22.29 0 top
C13  26.35,23.81 90 top
C14  44.13,23.81 90 top
C15  61.91,23.81 90 top
C16  79.69,23.81 90 top
C17  9.98,18.8 0 top
C18  7.12,17.84 270 top
C19  39.05,17.46 90 top
C20  40.64,17.46 90 top
C21  56.83,17.46 90 top
C22  58.42,17.46 90 top
C23  74.61,17.46 90 top
C24  76.2,17.46 90 top
C25  92.39,17.46 90 top
C26  93.98,17.46 90 top
C27  18.1,15.62 0 top
C28  26.35,16.83 270 top
C29  44.13,16.83 270 top
C30  61.91,16.83 270 top
C31  79.69,16.83 270 top
C32  57.94,14.61 0 top
C33  40.16,14.61 0 top
C34  75.72,14.61 0 top
C35  93.5,14.61 0 top
C36  26.35,12.06 270 top
C37  44.13,12.06 270 top
C38  61.91,12.06 270 top
C39  79.69,12.06 270 top
C40  24.83,39.5 270 top
C41  33.73,46.86 0 top
C42  30.23,46.82 0 top
C43  76.3,38.56 270 top
C44  118.11,26.67 270 top
C67  98.81,33.53 0 top
C68  93.98,33.53 180 top
CON3  115.95,34.04 0 top
CON4  107.19,47.94 180 top
CON5  71.18,41.15 90 top
CON6  107.19,41.08 180 top
CON7  107.19,34.04 180 top
CON8  20.45,7.75 180 top
CON9  31.75,3.81 0 top
CON10  49.53,3.81 0 top
CON11  67.31,3.81 0 top
CON12  83.57,3.81 0 top
CON13  95.89,3.81 0 top
CON14  112.98,7.65 180 top
CON15  116.2,12.19 0 top
D1  20.32,28.32 0 top
H1  5,47.63 0 top
H2  117.7,47.63 0 top
H3  5,5 0 top
H4  117.38,5 0 top
IC1  79.86,46.69 90 top
IC2  34.16,40.01 90 top
IC3  57.78,38.61 270 top
IC4  12.7,22.61 270 top
IC5  33.02,15.24 90 top
IC6  50.8,15.24 90 top
IC7  68.58,15.24 90 top
IC8  86.36,15.24 90 top
IC9  79.86,38.56 0 top
JP1  26.92,49.66 270 top
JP2  41.4,49.66 0 top
JP3  30.35,49.66 0 top
JP4  26.92,34.9 270 top
JP5  41.25,32.33 90 top
JP6  50.19,31.7 180 top
L2  6.55,31.38 90 top
L4  19.71,38.81 0 top
LED1  31.88,33.46 90 top
LED2  10.52,46.84 0 top
LED3  98.74,22.54 180 top
LED4  111.82,26.48 0 top
Q3  119.13,39.88 180 top
R1  80.01,50.65 180 top
R2  64.26,48.51 90 top
R3  35.69,33.46 0 top
R4  83.67,41.3 90 top
R6  26.86,39.5 270 top
R9  26.87,42.77 270 top
R12  18.41,35.31 180 top
R13  21.59,35.31 180 top
R14  43.23,45.4 270 top
R16  41.01,45.4 270 top
R17  10.49,42.42 270 top
R19  28.57,27.3 90 top
R20  46.35,27.3 90 top
R21  81.86,27.36 270 top
R22  64.14,26.67 270 top
R23  94.61,26.67 270 top
R24  96.84,26.67 270 top
R25  100.01,26.67 90 top
R26  101.92,26.67 90 top
R27  33.02,25.4 90 top
R28  50.8,25.4 90 top
R29  68.58,25.4 90 top
R30  86.36,25.4 90 top
R31  39.37,20.64 180 top
R32  57.15,20.64 180 top
R33  74.93,20.64 180 top
R34  92.71,20.64 180 top
R35  9.98,16.89 180 top
R36  42.23,17.46 270 top
R37  60.01,17.46 270 top
R38  77.79,17.46 270 top
R39  95.57,17.46 270 top
R40  40.96,12.38 180 top
R41  58.74,12.38 180 top
R42  76.52,12.38 180 top
R43  94.3,12.38 180 top
R44  34.92,8.57 0 top
R45  52.7,8.57 0 top
R46  70.48,8.57 0 top
R47  88.27,8.57 0 top
R48  107.63,26.67 270 top
R49  113.98,26.67 90 top
R50  116.2,26.67 90 top
R51  109.86,26.67 270 top
R86  115.32,40.89 0 top
R87  115.32,38.86 180 top
S2  68.83,48.7 0 top
T1  99.06,13.49 180 top
T2  110.17,16 180 top
TP1  37.47,25.4 0 top
TP2  55.24,25.4 0 top
TP3  73.03,25.4 0 top
TP4  90.81,25.4 0 top
TP5  83.67,37.9 0 top
TP6  76.81,42.27 0 top
TP7  16.05,33.53 0 top
TP8  23.57,19.1 0 top
U$1  92.96,43.69 0 top
X2  17.89,46.86 270 top
Y1  57.09,49.05 180 top

### Tracks (layer width: path | path; a pad name or v marks a point on that pad's centre or on a via)
+5V  (via drill 0.33, 0.41, 0.6)
  Top 0.254: v34.61,21.91 34.29,21.59 34.29,19.05 34.52,18.82 IC5.13 35.82,18.79 35.88,18.73 35.82,18.68 IC5.12 | v52.39,21.91 52.07,21.59 52.07,19.05 52.3,18.82 IC6.13 53.6,18.2 53.58,18.18 IC6.12 | v70.17,21.91 69.85,21.59 69.85,19.05 70.08,18.82 IC7.13 71.38,18.2 71.36,18.18 IC7.12 | v88.27,21.91 87.63,21.27 87.63,19.05 87.86,18.82 IC8.13 89.16,18.2 89.14,18.18 IC8.12
  Top 0.305: IC6.17 47.08,18.16 46.83,18.41 46.83,18.73 v46.2,19.37 46.04,19.37 | 46.04,19.37 | IC6.27 47.23,11.66 46.67,11.11 46.67,10.48 v46.35,10.16 | IC5.17 29.3,18.16 29.05,18.41 29.05,18.73 v28.42,19.37 | IC5.27 29.45,11.66 28.89,11.11 28.89,10.48 v28.57,10.16 | IC5.10 37.43,16.86 v37.78,16.51 | IC7.17 64.86,18.16 64.61,18.41 64.61,18.73 v63.98,19.37 | IC7.27 65,11.66 64.45,11.11 64.45,10.48 v64.14,10.16 | IC8.17 82.64,18.16 82.39,18.41 82.39,18.73 v81.76,19.37 | IC8.27 82.78,11.66 82.23,11.11 82.23,10.48 v81.92,10.16 | R2.2 v64.26,50.74 | R25.2 v100.01,28.57 | R49.2 113.98,28.57 v112.27,30.29 | IC9.3 80.81,36.1 80.67,35.97 79.05,35.97 78.91,36.1 IC9.1 | R12.2 17.57,33.62 v18.1,33.08 | IC2.20 32.98,40.98 36.23,37.73 IC2.4 39.36,37.73 41.71,40.08 C5.1 | R16.2 40.18,44.55 v39.47,45.26 | IC3.27 56.98,31.59 55.09,29.69 C8.1 | C43.1 74.97,39.71 v74.83,39.56
  Top 0.406: IC6.10 55.21,16.86 v55.56,16.51 56.83,16.51 C21.1 | IC7.10 72.99,16.86 v73.34,16.51 74.61,16.51 C23.1 | IC8.10 90.77,16.86 v91.12,16.51 92.39,16.51 C25.1 | v53.7,38.61 53.5,38.61 IC3.17 | v58.58,42.89 | IC3.5 58.59,42.9 v58.58,42.89 | v61.87,37.81 62.07,37.81 62.08,37.81 IC3.38 | v56.99,34.73 56.99,34.32 56.98,34.32 IC3.27 | v64.14,24.45 R22.2 | R20.2 v46.35,29.53 | R19.2 v28.57,29.53 | C19.1 39.05,16.51 v37.78,16.51 | IC2.20 29.3,40.98 v28.7,40.39 | IC1.14 76.91,44.4 76.81,44.3 | R16.2 R14.2 | R21.2 81.86,25.31 v81.92,25.26 | R17.2 10.49,40.72 10.86,40.35 v11.86,40.35
  Top 0.61: v63.98,19.37 63.98,22.38 v63.82,22.54 | v81.76,19.37 81.76,22.38 v81.6,22.54 | v28.42,19.37 28.42,22.07 v28.26,22.23 | v46.2,19.37 46.2,21.75 v46.04,21.91 | IC9.1 78.91,37.53 76.73,39.71 C43.1 76.3,39.93 76.4,40.03 75.39,41.05 75.39,42.88 76.81,44.3
  supply 0.305: 57.78,18.73 57.78,22.23 | 40.01,18.73 40.01,22.23 | 75.56,18.73 75.56,22.23 | 93.34,18.73 93.34,20.95
  supply 0.406: v55.56,16.51 57.78,18.73 | v37.78,16.51 40.01,18.73 | v73.34,16.51 75.56,18.73 | v91.12,16.51 93.34,18.73 | v28.7,40.39 28.7,45.34 JP1.2
  supply 0.61: v46.35,10.16 45.72,10.16 45.09,10.79 45.09,18.26 v46.2,19.37 | v28.57,10.16 27.94,10.16 27.3,10.79 27.3,18.34 v28.42,19.37 | v64.14,10.16 63.5,10.16 62.87,10.79 62.87,18.26 v63.98,19.37 | v81.92,10.16 81.28,10.16 80.64,10.79 80.64,18.26 v81.76,19.37
  other vias: 18.1,32.13 18.1,31.18
  pour supply (rank 2): 112.46,52.46 112.46,20.83 26.99,20.64 15.24,32.38 15.24,36.51 10.97,36.51 10.97,52.63 77.01,52.43 77.01,31.7 102.01,31.7 102.01,52.46
  pour Top: 0.2,42.47 7.11,42.47 7.11,39.22 9.35,39.22 9.35,36.78 17.27,36.78 17.27,35.97 20.52,35.97 20.52,30.07 0.2,30.07
CTS  (via drill 0.3)
  Top 0.305: IC2.11 35.78,42.28 v35.56,42.06
  Bottom 0.305: v35.56,42.06 34.14,42.06 JP4.1
DTR  (via drill 0.3)
  Top 0.305: IC2.2 35.62,36.43 v34.75,35.56
  Bottom 0.305: v34.75,35.56 31.9,35.56 29.06,32.72 27.33,32.72 JP4.2
EXTR_EN  (via drill 0.33)
  Top 0.305: IC8.26 82.64,12.31 81.76,11.43 v81.6,11.43 | IC3.43 65.06,41.81 v65.09,41.78
  Inner 2 0.305: v81.6,11.43 80.96,12.06 80.96,14.29 83.5,16.83 86.93,16.83 87.58,17.48 87.58,18.49 86.77,19.3 86.77,23.77 81.69,28.85 70.08,28.85 64.45,34.48 64.45,41.15 v65.09,41.78
EXTRDIR  (via drill 0.33)
  Top 0.305: IC3.42 65.07,41.01 v65.25,40.83 | IC8.3 90.4,12.31 v91.28,11.43
  Inner 2 0.305: v65.25,40.83 65.25,40.35 65.09,40.2 65.09,35 69.41,30.68 82.09,30.68 89.22,23.56 89.22,13.49 v91.28,11.43
EXTRSTEP  (via drill 0.33)
  Top 0.305: IC8.19 81.95,16.86 v81.92,16.83 | IC3.44 64.64,42.61 v65.09,43.05
  Inner 2 0.305: v81.92,16.83 84.77,19.68 84.77,23.74 80.47,28.04 69.62,28.04 66.36,31.3 66.2,31.46 63.82,33.85 63.82,41.78 v65.09,43.05
FAN1  (via drill 0.3)
  Top 0.305: IC3.41 64.82,40.21 65.02,40.01 66.88,40.01 v67.87,39.01 | v111.96,45.11 111.96,43.4 R86.1
  Top 0.406: R86.1 R87.2
  Bottom 0.305: v67.87,39.01 67.87,38.41 70.31,35.97 82.7,35.97 90.02,43.28 100.79,43.28 103.23,45.72 109.32,45.72 109.53,45.92 111.15,45.92 v111.96,45.11
GND  (via drill 0.33, 0.41, 0.6, 0.7)
  Top 0.305: C32.2 59.37,14.61 v59.69,14.61 59.69,13.02 R41.1 | R40.1 41.91,13.02 v41.91,14.61 C33.2 40.96,14.61 | C34.2 v77.47,14.61 77.47,13.02 R42.1 | C35.2 v95.25,14.61 95.25,13.02 R43.1 | LED2.C v10.52,49.49 | R36.1 42.23,18.41 v41.43,18.41 40.64,18.41 | 40.64,18.41 C20.2 | C19.2 39.05,18.41 40.64,18.41 | v103.82,24.77 C10.2 | C40.2 23.17,38.65 v23.15,38.63 | IC3.28 57.78,31.62 58.73,30.68 58.73,29.32 C9.2
  Top 0.406: IC4.7 14.61,23.24 13.34,21.97 IC4.3 | R35.1 10.62,16.89 10.62,18.8 C17.2 10.94,18.8 | v57.78,42.06 IC3.6 | v54.5,37.81 54.29,37.81 IC3.18 | IC3.28 v57.78,35.52 | v61.07,38.81 61.28,38.61 IC3.39 | R27.1 29.41,24.25 v29.21,24.45 | R28.1 47.19,24.25 v46.99,24.45 | R29.1 66.33,23.04 v66.04,22.75 | 82.75,24.25 R30.1 | C8.2 C9.2 | IC5.16 31.03,18.82 v31.75,18.1 | IC6.16 48.81,18.82 v49.53,18.1 | IC7.16 66.59,18.82 v67.31,18.1 | IC8.16 84.37,18.82 v85.09,18.1
  Top 0.61: C14.2 v44.13,26.67 | C13.2 v26.35,26.67 | C15.2 v61.91,26.67 | C16.2 79.69,25.4 v79.69,26.67
  Top 1.016: v60.01,21.27 58.42,21.27 58.42,20.64 | v60.01,20 58.42,20 58.42,20.64 | 58.42,20.64 R32.1 | v42.23,21.27 40.96,21.27 40.96,20.64 | v42.23,20 40.96,20 40.96,20.64 | 40.96,20.64 R31.1 | v77.79,21.27 76.52,21.27 | v77.79,20 76.2,20 76.2,20.32 76.52,20.64 R33.1 | v95.57,21.27 94.3,21.27 | v95.57,20 94.3,20 94.3,20.64 R34.1
  other vias: 50.16,19.05 50.8,18.1 49.53,12.06 50.8,12.06 52.07,12.06 50.8,10.79 52.07,10.79 59.21,18.41 32.38,19.05 33.02,18.1 31.75,12.06 33.02,12.06 34.29,12.06 33.02,10.79 34.29,10.79 67.94,19.05 68.58,18.1 67.31,12.06 68.58,12.06 69.85,12.06 68.58,10.79 69.85,10.79 76.99,18.41 85.72,19.05 86.36,18.1 85.09,12.06 86.36,12.06 87.63,12.06 86.36,10.79 87.63,10.79 94.77,18.41 98.42,14.13 99.69,14.13 100.97,14.13 102.23,14.13 102.23,15.4 102.23,16.67 102.23,17.94 100.97,17.94 99.69,17.94 98.42,17.94 98.42,19.21 99.69,19.21 100.97,19.21 102.23,19.21 53.26,50.72 82.35,24.04 109.54,16.48 110.81,16.48 112.08,16.48 113.35,16.48 113.35,18.07 113.35,19.34 113.35,20.61 112.08,20.61 110.81,20.61 109.54,20.61 37.74,45.32 109.54,21.88 110.81,21.88 112.08,21.88 113.35,21.88 113.35,23.15 112.08,23.15 110.81,23.15 109.54,23.15 114.62,23.15 114.62,21.88 114.62,20.61 114.62,19.34 114.62,18.07 114.62,16.48 115.89,21.88 115.89,19.34 80.89,44.08 84.34,48.34 74.79,37.37 32.91,39.24 14.01,38.43
  pour Bottom (rank 6, no thermals): 0,0 0,52.63 85.72,52.32 122.38,52.38 122.38,0
  pour Top (rank 5, no thermals): 121.92,29.53 23.81,29.53 23.77,37.39 23.77,39.01 9.96,39.01 9.96,40.64 7.87,40.64 7.87,52.32 0,52.32 0,0.32 121.92,0.32
  pour Top (rank 5, no thermals): 121.6,30.42 24.89,30.48 24.89,38.35 24.89,39.62 10.67,39.62 10.67,41.27 8.64,41.27 8.64,52.32 121.67,52.32 121.67,51.82
  pour Inner 2 (rank 5, no thermals): 0.32,52.07 85.72,52.07 122.49,52.32 122.24,0.32 0.32,0.32
HEAT  (via drill 0.33)
  Top 0.305: IC3.15 53.65,40.21 54.29,39.56 59.69,39.56 v61.59,41.47 | R24.1 94.72,27.52 94.61,27.62 R23.1 93.56,28.57 v90.81,28.57
  Inner 2 0.305: v61.59,41.47 64.14,44.01 65.41,44.01 66.04,43.37 66.04,35.36 69.9,31.5 82.5,31.5 85.42,28.57 v90.81,28.57
HEAT2
  Top 0.305: R48.1 107.63,28.89 106.3,30.23 91.95,30.23 91.49,30.68 87.17,30.68 84.53,33.33 75.18,33.33 72.95,35.56 67.87,35.56 67.22,36.21 IC3.36
  Top 0.406: R48.1 R51.1
MISO  (via drill 0.3)
  Top 0.305: IC3.2 60.98,45.34 61.37,45.72 64.21,45.72 67.67,42.27 67.67,40.84 68.68,39.83 71.23,39.83 CON5.1 | IC1.12 74.28,46.03 v73.97,45.72
  Bottom 0.305: v73.97,45.72 73.97,44.5 74.37,44.09 74.37,40.53 CON5.1
MOSI  (via drill 0.3, 0.33)
  Top 0.305: 61.91,44.32 v62.87,44.32 | IC1.11 74.42,46.69 v73.76,47.35
  Top 0.406: 61.91,44.32 61.83,44.41 IC3.1
  Bottom 0.305: v73.76,47.35 64.41,47.35 62.87,45.8 v62.87,44.32 63.04,44.5 66.04,44.5 69.39,41.15 CON5.4
N$1
  Top 0.406: IC5.24 28.22,13.62 27.62,13.02 27.62,12.38 26.99,11.75 26.99,10.48 26.67,10.48 26.35,10.79 C36.2
N$2
  pour Top (rank 4, no thermals): 34.92,19.37 38.73,19.37 38.73,21.91 36.2,21.91 34.92,20.64
N$3
  pour Top (rank 4, no thermals): 34.92,11.11 37.47,11.11 37.47,7.14 35.4,7.14 34.92,7.62
N$4
  Top 0.406: IC5.23 27.6,14.27 27.3,13.97 26.35,13.97 C36.1
N$5
  Top 0.406: C28.2 26.22,15.43 26.04,15.24 26.36,14.91 IC5.22
N$6
  Top 0.305: IC3.14 50.18,41.01 49.53,41.66 49.53,42.67 44.83,47.37 44.7,47.5 43.18,47.5 41.4,49.28 JP2.1
N$7
  Top 0.305: IC2.3 39.73,37.08 40.28,37.63 C7.2
N$8
  Top 0.305: IC5.20 29.23,16.21 28.89,15.88 28.26,15.88 27.62,16.51 27.62,20 26.35,21.27 C13.1
N$9
  Top 0.305: IC5.9 36.81,16.21 37.31,15.72 40.48,15.72 40.64,15.88 40.64,16.51 | 40.64,16.51 C20.1 | R36.2 42.23,16.51 40.64,16.51
N$10
  Top 0.305: IC5.6 39.03,14.27 39.31,14.55 C33.1 39.31,13.39 39.37,13.34 40.01,13.34 40.11,13.23 R40.2
N$11
  Top 0.406: R19.1 28.57,26.35 28.77,26.55 R27.3
N$12  (via drill 0.33)
  Top 0.406: IC5.4 37.52,12.96 v37.78,12.7
  Bottom 1.016: v37.78,12.7 37.47,12.7 36.83,12.06 36.83,6.35 35.56,5.08 CON9.1
N$13  (via drill 0.33)
  Top 0.305: IC5.8 36.66,15.56 37.23,15 v37.47,15
  Top 0.406: R27.2 TP1.PP v39.37,23.5
  Inner 2 0.305: v37.47,15 38.5,15 39.37,15.88 v39.37,23.5
N$14
  Top 0.305: IC3.13 50.65,41.81 50.29,42.16 50.29,44.7 49.53,45.47 48.13,45.47 JP2.2
N$15
  pour Top: 103.43,23.77 103.43,1.63 108.31,1.63 108.31,10.97 114,10.97 114,15.24 106.68,15.24 106.68,23.77
N$16  (via drill 0.33)
  Top 0.406: IC5.25 28.84,12.96 v28.57,12.7
  Inner 2 1.016: v28.57,12.7 29.21,12.7 31.75,10.16 31.75,8.26 33.02,6.99 CON9.2
N$17  (via drill 0.33)
  Top 0.406: IC5.11 37.2,17.52 37.47,17.78
  Top 0.813: v37.47,18.41 37.47,17.78
  Bottom 1.016: v37.47,18.41 36.83,18.41 35.56,17.14 35.56,10.16 30.48,5.08 CON9.3
N$18  (via drill 0.5)
  Top 0.305: IC5.18 28.84,17.52 v28.42,17.94
  Inner 2 1.016: v28.42,17.94 27.15,17.94 26.67,17.46 26.67,9.21 27.94,7.94 CON9.4
N$19
  Top 0.305: LED1.A R3.1
N$20
  Top 0.305: LED2.A 10.52,44.31 R17.1
N$21
  Top 0.305: R24.2 96.84,24.45 97.47,23.81 98.74,23.81 LED3.A
N$22
  pour Top (rank 4, no thermals): 52.7,19.37 56.52,19.37 56.52,21.91 53.98,21.91 52.7,20.64
N$23
  pour Top (rank 4, no thermals): 52.7,11.11 55.24,11.11 55.24,7.14 53.02,7.14 52.7,7.46
N$24
  Top 0.406: IC6.24 46,13.62 45.4,13.02 45.4,12.38 44.77,11.75 44.77,10.79 44.45,10.79 44.29,10.64 44.26,10.66 C37.2
N$25
  Top 0.406: IC6.23 45.38,14.27 45.09,13.97 44.45,13.97 44.45,13.65 44.13,13.34 C37.1
N$26
  Top 0.406: 44.13,15.56 44.13,15.88 | 44.13,15.56 C29.2 | IC6.22 44.77,14.91 44.13,15.56
N$27
  Top 0.305: C14.1 44.13,21.27 45.4,20 45.4,16.51 46.04,15.88 46.67,15.88 47.01,16.21 IC6.20
N$28
  Top 0.305: IC6.9 54.75,16.21 55.09,15.88 | 55.09,15.88 | 55.09,15.88 55.24,15.72 58.26,15.72 58.42,15.88 58.42,16.51 | 58.42,16.51 C22.1 | R37.2 60.01,16.51 58.42,16.51
N$29
  Top 0.305: IC6.6 56.81,14.27 56.99,14.61 56.99,14.45 56.94,14.34 | 56.94,14.34 C32.1 | 56.94,14.34 56.99,14.29 56.99,13.49 57.15,13.34 57.63,13.34 57.89,13.07 R41.2
N$30
  Top 0.305: IC3.29 58.59,31.84 60.48,29.95 C9.1
N$31
  Top 0.406: R20.1 46.35,26.67 46.48,26.55 R28.3
N$32  (via drill 0.33)
  Top 0.305: IC6.8 54.44,15.56 55.01,15 v55.24,15
  Top 0.406: R28.2 TP2.PP v57.15,23.5
  Inner 2 0.305: v55.24,15 55.96,15 56.99,16.03 | 56.99,16.03 57.15,16.19 | 57.15,16.19 56.99,16.03 | 56.99,16.03 | 57.15,16.19 v57.15,23.5
N$33
  Top 0.813: T2.4 108.27,24.36 107.63,24.99 R48.2
N$34
  Top 0.305: 116.2,24.45 116.2,24.38 117.98,22.61 117.98,15.75 116.2,13.97 CON15.1
  Top 0.406: R49.1 R50.1 116.2,24.45
N$35
  Top 0.305: LED4.A 110.25,25.43 R51.2
N$36  (via drill 0.5)
  Top 0.406: IC6.4 55.3,12.96 v55.56,12.7
  Bottom 1.016: v55.56,12.7 55.24,12.7 54.61,12.06 54.61,6.35 53.34,5.08 CON10.1
N$37  (via drill 0.5)
  Top 0.406: IC6.25 46.62,12.96 v46.35,12.7
  Inner 2 1.016: CON10.2 50.8,6.99 49.53,8.26 49.53,10.16 46.99,12.7 v46.35,12.7
N$38  (via drill 0.33)
  Top 0.406: IC6.11 54.98,17.52 55.24,17.78
  Top 1.016: v55.24,18.41 55.24,17.78
  Bottom 1.016: CON10.3 48.26,5.08 53.34,10.16 53.34,17.14 54.61,18.41 v55.24,18.41
N$39  (via drill 0.5)
  Top 0.406: IC6.18 46.62,17.52 v46.2,17.94
  Inner 2 1.016: CON10.4 45.72,7.94 44.45,9.21 44.45,17.3 45.09,17.94 v46.2,17.94
N$40
  Top 0.305: IC3.12 51.98,44.79 50.04,46.74 49.4,46.74 JP2.3
N$41
  Top 0.305: IC3.11 53.78,46.04 53.59,46.23 51.82,46.23 50.8,47.24 50.8,47.88 JP2.4
N$42
  Top 0.406: L4.2 21.41,39.29 24.38,42.27 24.38,48.36 24.99,48.97 25.4,49.38 25.68,49.66 JP1.1
N$43
  pour Top (rank 4, no thermals): 70.48,19.37 74.3,19.37 74.3,21.91 71.75,21.91 70.48,20.64
N$44
  pour Top (rank 4, no thermals): 70.48,11.11 73.03,11.11 73.03,7.14 70.96,7.14 70.48,7.62
N$45
  Top 0.406: IC7.24 63.78,13.62 63.18,13.02 63.18,12.38 62.55,11.75 62.55,10.79 62.23,10.79 61.91,10.48 C38.2
N$46
  Top 0.406: IC7.23 63.16,14.27 62.87,13.97 62.23,13.97 61.91,13.65 C38.1
N$47
  Top 0.406: C30.2 61.91,14.92 61.92,14.91 IC7.22
N$48
  Top 0.305: IC7.20 64.79,16.21 64.45,15.88 63.82,15.88 63.18,16.51 63.18,20 61.91,21.27 C15.1
N$49
  Top 0.305: IC7.9 72.37,16.21 72.71,15.88 72.87,15.72 76.04,15.72 76.2,15.88 76.2,16.51 | 76.2,16.51 C24.1 | R38.2 77.79,16.51 76.2,16.51
N$50
  Top 0.305: IC7.6 74.91,14.27 74.93,14.29 | C34.1 74.87,14.34 74.93,14.29 | 74.93,14.29 74.93,13.34 75.56,13.34 75.67,13.23 R42.2
N$52
  Top 0.406: R29.3 66.33,26.7 65.41,27.62 64.14,27.62 R22.1
N$53  (via drill 0.33)
  Top 0.305: IC7.8 72.22,15.56 72.79,15 v73.03,15
  Top 0.406: R29.2 TP3.PP v74.93,23.5
  Inner 2 0.305: v73.03,15 74.93,16.91 v74.93,23.5
N$56
  Top 0.305: IC1.8 76.91,50.09 77.47,50.65 R1.2
N$57  (via drill 0.33)
  Top 0.406: IC7.4 73.08,12.96 v73.34,12.7
  Bottom 1.016: v73.34,12.7 73.03,12.7 72.39,12.06 72.39,6.35 71.12,5.08 CON11.1
N$58  (via drill 0.33)
  Top 0.406: IC7.25 64.4,12.96 v64.14,12.7
  Inner 2 1.016: v64.14,12.7 64.77,12.7 67.31,10.16 67.31,8.26 68.58,6.99 CON11.2
N$59  (via drill 0.33)
  Top 0.406: IC7.11 72.76,17.52 73.03,17.78
  Top 1.016: v73.03,18.41 73.03,17.78
  Bottom 1.016: v73.03,18.41 72.39,18.41 71.12,17.14 71.12,10.16 66.04,5.08 CON11.3
N$60  (via drill 0.33)
  Top 0.406: IC7.18 64.4,17.52 v63.98,17.94 | v63.98,17.94
  Inner 2 1.016: v63.98,17.94 63.02,17.94 62.23,17.14 62.23,9.21 63.5,7.94 CON11.4
N$61
  Top 0.305: TP5.1 R4.1 82.31,40.45 81.88,40.02 IC9.4
N$64
  pour Top (rank 4, no thermals): 88.27,19.37 92.08,19.37 92.08,21.91 89.53,21.91 88.27,20.64
N$65
  pour Top (rank 4, no thermals): 88.27,11.11 90.81,11.11 90.81,7.14 88.74,7.14 88.27,7.62
N$66
  Top 0.406: IC8.24 81.56,13.62 80.96,13.02 80.96,12.38 80.33,11.75 80.33,10.79 79.69,10.79 C39.2
N$67
  Top 0.406: IC8.23 81.26,14.27 80.96,13.97 80.01,13.97 80.01,13.65 79.69,13.34 | 79.69,13.34 | C39.1 79.69,13.34
N$68
  Top 0.406: IC8.22 80.97,14.91 80.64,15.24 80.01,15.24 79.82,15.43 C31.2
N$69
  Top 0.406: IC8.20 82.57,16.21 82.23,15.88 81.6,15.88 80.96,16.51 80.96,20 79.69,21.27 79.69,22.54 C16.1
N$70
  Top 0.305: IC8.9 90.47,16.21 90.81,15.88 | 90.81,15.88 | 90.81,15.88 90.96,15.72 93.82,15.72 93.98,15.88 93.98,16.51 | 93.98,16.83 C26.1 93.98,16.51 | 95.57,16.51 | 95.57,16.51 R39.2 | 93.98,16.51 95.57,16.51
N$71
  Top 0.305: IC8.6 92.69,14.27 92.71,14.29 92.65,14.34 C35.1 92.65,14.55 92.39,14.29 92.39,13.65 92.71,13.34 93.34,13.34 93.45,13.23 R43.2
N$73
  Top 0.406: R30.3 84.11,26.84 82.74,28.21 R21.1
N$74  (via drill 0.33)
  Top 0.305: IC8.8 90.16,15.56 90.73,15 v90.96,15
  Top 0.406: R30.2 TP4.PP v92.71,23.5
  Inner 2 0.305: v90.96,15 92.71,16.75 v92.71,23.5
N$78  (via drill 0.33)
  Top 0.406: IC8.4 90.86,12.96 v91.12,12.7
  Bottom 1.016: v91.12,12.7 90.81,12.7 90.17,12.06 90.17,8.51 87.38,5.71 CON12.1
N$79  (via drill 0.33)
  Top 0.406: IC8.25 82.18,12.96 v81.92,12.7
  Inner 2 1.016: v81.92,12.7 82.55,12.7 85.09,10.16 85.09,7.37 84.84,7.11 CON12.2
N$80  (via drill 0.33)
  Top 0.406: IC8.11 90.54,17.52 90.81,17.78
  Top 1.016: v90.81,18.41 90.81,17.78
  Bottom 1.016: v90.81,18.41 90.17,18.41 88.9,17.14 88.9,9.91 86.49,7.49 83.69,7.49 82.3,6.1 CON12.3
N$81  (via drill 0.33)
  Top 0.406: IC8.18 82.34,17.52 v81.76,18.1
  Inner 2 1.016: v81.76,18.1 80.96,18.1 80.01,17.14 80.01,6.48 79.76,6.22 CON12.4
N$91
  Top 0.406: C18.2 7.12,16.89 R35.2
N$92
  Top 0.406: 9.84,20.7 IC4.4 | C18.1 7.02,18.69 7.12,18.8 C17.1
  Top 0.61: 9.84,20.7 9.84,20.41 9.35,19.91 9.14,19.71 9.13,19.7 C17.1
N$93  (via drill 0.33)
  Top 0.305: 20.95,35.31 R13.2 R12.1 19.19,35.31 v19.19,36.66 | 15.24,20.7 IC4.5 v17.14,20.7
  Bottom 0.305: v17.14,20.7 17.86,20.7 19.1,21.95 19.1,28.65 19.91,29.46 19.91,35.94 v19.19,36.66
N$94
  pour Top: -0.61,29.46 19.51,29.46 19.51,26.01 12.8,26.01 12.8,24.18 -0.61,24.18
N$95
  pour Top (rank 3, no thermals): 96.52,11.59 101.6,11.59 101.6,6.35 95.25,6.35 93.98,5.08 93.98,2.54 93.34,1.91 92.08,1.91 91.44,2.54 91.44,9.84 91.76,10.16 95.89,10.16 96.52,10.79
N$96
  Top 0.61: T1.4 97.16,21.91 94.61,24.45 R23.2
N$98  (via drill 0.33)
  Top 0.305: 101.92,25.72 R26.1 | R25.1 101.81,25.82 101.92,25.72 | v101.92,24.77 101.92,25.72
  Bottom 0.305: v101.92,24.77 101.92,24.13 104.46,21.59 104.46,13.02 99.69,8.26 CON13.1
N$100
  Top 0.305: R6.2 26.86,38.44 25.81,37.39 20.52,37.39 19,38.91
  Top 0.406: X2.1 19.49,42.89 20.52,41.86 20.52,40.23 19.91,39.62 19.71,39.62 19,38.91 18.9,38.81 L4.1
N$105  (via drill 0.3)
  Top 0.305: C41.1 32.88,44.26 32.2,43.58 IC2.16 29.37,43.58 28.65,44.3 28.65,44.7 28.45,44.91 v27.64,44.91 | X2.2 18.69,42.06 v19.3,41.45
  Bottom 0.305: v19.3,41.45 22.55,41.45 26.01,44.91 v27.64,44.91
N$106  (via drill 0.3)
  Top 0.305: IC2.15 29.73,44.23 29.38,44.59 29.38,44.7 | 29.38,44.7 C42.1 | v30.48,45.31 29.99,45.31 29.38,44.7 | X2.3 17.89,41.24 v18.69,40.44
  Bottom 0.305: v30.48,45.31 30.28,45.11 29.38,45.11 28.16,43.89 26.42,43.89 22.96,40.44 v18.69,40.44
N$107
  Top 0.305: 27.17,41.63 IC2.19 | 27.17,41.63 R9.2 | 27.17,41.63 26.86,41.32 R6.1 C40.1
N$110
  Top 0.305: C1.1 52.38,47.85 Y1.3 56.19,46.75 IC3.8
N$111
  Top 0.305: C2.1 59.14,50.3 Y1.1 58.78,50.25 57.81,49.28 57.3,48.77 56.98,48.45 IC3.7
N$117
  Top 0.406: Q3.1 120.08,41.87 119.28,42.67 116.84,42.67 116.43,42.27 116.23,42.06 116.17,42 R86.2
N$118
  Top 0.406: CON3.2 118.49,38.14 Q3.3
RESET  (via drill 0.3)
  Top 0.305: C7.1 44.58,38.07 46.94,40.44 46.94,42.67 v47.55,43.28 | v59.74,42.06 59.74,42.67 59.38,43.03 IC3.4 59.38,45.77 60.76,47.14 63.74,47.14 R2.1 65.13,46.8 S2.3 66.36,46.74 69.29,46.74 72.34,43.69 CON5.5
  Bottom 0.305: v47.55,43.28 54.86,43.28 56.9,41.25 58.93,41.25 v59.74,42.06
RXD  (via drill 0.3)
  Top 0.305: R3.2 36.6,33.53 37.39,33.53 37.79,33.93 IC2.1 38.59,35.78 v39.22,35.15 | v55.27,41.66 55.27,42.47 55.38,42.58 IC3.9
  Inner 2 0.305: v55.27,41.66 54.66,41.05 44.7,41.05 39.62,35.97 39.62,35.56 v39.22,35.15
  Bottom 0.305: JP5.1 41.02,32.33 39.22,34.14 v39.22,35.15
SCK
  Top 0.305: IC3.3 60.19,45.45 61.16,46.43 64.52,46.43 65.63,45.31 66.24,45.31 69.09,42.47 71.13,42.47 CON5.3 72.56,41.25 72.95,41.25 73.97,42.27 73.97,44.3 75.05,45.38 IC1.13
SCL  (via drill 0.3)
  Top 0.305: JP3.4 38.33,49.66 40.64,47.35 42.27,47.35 43.23,46.38 R14.1 | IC3.19 49.76,37.01 v49.38,37.39
  Bottom 0.305: v49.38,37.39 44.7,42.06 44.7,44.91 42.27,47.35 40.64,47.35 38.33,49.66 JP3.4
SDA  (via drill 0.3)
  Top 0.305: JP3.3 35.43,49.3 36.58,48.16 38.61,48.16 40.51,46.25 R16.1 | v48.56,36.58 48.93,36.21 IC3.20 54.29,36.21 v56.69,38.61 | IC1.10 75.19,47.34 v74.98,47.55
  Bottom 0.305: v48.56,36.58 42.06,43.08 42.06,44.7 38.61,48.16 36.65,48.16 35.43,49.38 JP3.3 | v56.69,38.61 57.51,38.61 60.76,41.86 60.76,45.52 63.6,48.36 74.17,48.36 v74.98,47.55
TGT_MISO1
  Top 0.305: IC1.3 81.78,46.03 81.48,46.33 81.48,48.97 82.09,49.58 84.33,49.58 85.75,48.16 87.78,48.16 88.8,49.17 96.11,49.17 97.62,47.66 U$1.7
TGT_MOSI1
  Top 0.305: IC1.4 88.04,46.69 90.22,44.5 92.86,44.5 93.22,44.86 U$1.3
TGT_SCK1
  Top 0.305: IC1.2 87.71,45.38 90.02,43.08 94.49,43.08 95.1,43.69 95.3,43.89 95.42,44.01 U$1.5
TGT_SSEL1
  Top 0.305: IC1.5 87.97,47.34 89,48.36 91.03,48.36 92.12,47.27 U$1.2
THERM  (via drill 0.33)
  Top 0.305: IC3.32 60.98,31.92 61.28,31.62 71.12,31.62 v73.28,33.78 | C10.1 103.82,27.62 103.72,27.52 R26.2 v101.92,28.57
  Inner 2 0.305: v101.92,28.57 100.65,29.84 85.37,29.84 82.91,32.31 75.39,32.31 73.97,33.73 73.33,33.73 v73.28,33.78
THERM2
  Top 0.305: R50.2 116.2,29.21 113.67,31.75 89.05,31.75 88.8,31.5 87.38,31.5 87.17,31.7 84.73,34.14 75.39,34.14 72.95,36.58 68.07,36.58 67.64,37.01 IC3.37
  Top 0.406: R50.2 C44.1
TXD  (via drill 0.3)
  Top 0.305: IC2.5 38.99,38.38 39.83,39.22 39.83,40.44 v41.25,41.86 | 54.46,42.27 v54.25,42.06 54.59,42.39 IC3.10
  Inner 2 0.305: v41.25,41.86 54.05,41.86 v54.25,42.06
  Bottom 0.305: JP5.2 v41.25,41.86
V3P3  (via drill 0.41)
  Top 0.305: IC1.1 82.81,43.99 83.67,43.13 R4.2 | U$1.4 94.32,44.74 v94.28,44.7
  Top 0.406: C68.+ 95.38,35.48 v95.3,35.56 | C67.2 99.66,35.04 v99.77,35.15 | R1.1 82.45,50.65 v82.5,50.6 | IC1.1 81.66,44.73 81.28,45.11 80.47,45.11 | 80.47,45.11 80.26,45.11 78.71,43.55 C4.1 76.71,42.37 TP6.1 | v80.26,45.92 80.26,45.31 80.47,45.11
  Top 0.61: IC9.5 78.91,42.17 C4.1
  pour supply: 77.83,52.02 100.99,51.82 100.99,32.51 89.81,32.51 89.81,38.61 77.83,38.61
V3P3FT232
  Top 0.305: IC2.17 33.38,42.93 36.17,45.72 36.17,46.79 C3.1
V+  (via drill 0.6, 1)
  Top 0.305: IC6.28 48,9.79 v47.94,9.53
  Top 0.61: v44.13,19.68 C29.1 | v26.35,19.68 C28.1 | v61.91,19.68 C30.1 | C31.1 v79.69,19.68
  supply 0.61: v44.13,19.68 45.09,19.68 45.72,20.32 v47.31,20.32 | v26.35,19.68 27.3,19.68 27.94,20.32 v29.53,20.32 | v61.91,19.68 62.87,19.68 63.5,20.32 v65.09,20.32 | v79.69,19.68 80.64,19.68 81.28,20.32 v82.87,20.32
  supply 0.813: v47.31,20.32 47.31,20 47.94,19.37 | v29.53,20.32 29.53,20 30.16,19.37 | 82.87,20 v82.87,20.32
  supply 1.016: 65.09,20 v65.09,20.32 | v65.72,9.53 65.72,19.37
  supply 1.27: 47.94,19.37 v47.94,9.53 47.94,6.99 | 30.16,6.99 v30.16,9.53 30.16,19.37 | 65.72,6.99 v65.72,9.53 | 65.72,19.37 65.09,20 | 83.5,6.99 v83.5,9.53 83.5,19.37 82.87,20
  supply 1.422: 26.04,6.99 47.94,6.99 65.72,6.99 83.5,6.99 93.98,6.99 94.61,6.35 CON13.3
  other vias: 17.14,25.15 20.64,17.21 22.86,17.21 20.64,14.03 22.86,14.03
  pour Top (rank 3, no thermals): 18.87,12.59 18.87,19.88 24.31,19.88 24.31,12.59
  pour Top (rank 4, no thermals): 47.31,11.11 48.58,11.11 48.58,9.21 47.62,9.21 47.31,9.53
  pour Top (rank 4, no thermals): 48.58,19.37 48.58,20 47.94,20.64 47.31,20.64 46.99,20.32 46.99,19.37
  pour Top (rank 4, no thermals): 30.8,19.37 30.8,20 30.16,20.64 29.53,20.64 29.21,20.32 29.21,19.37
  pour Top (rank 4, no thermals): 66.36,19.37 66.36,20 65.72,20.64 65.09,20.64 64.77,20.32 64.77,19.37
  pour Top (rank 4, no thermals): 84.14,19.37 84.14,20 83.5,20.64 82.87,20.64 82.55,20.32 82.55,19.37
  pour Top (rank 4, no thermals): 29.53,11.11 30.8,11.11 30.8,9.21 29.84,9.21 29.53,9.53
  pour Top (rank 4, no thermals): 65.09,11.11 66.36,11.11 66.36,9.21 65.41,9.21 65.09,9.53
  pour Top (rank 4, no thermals): 82.87,11.11 84.14,11.11 84.14,9.21 83.19,9.21 82.87,9.53
  pour supply (isolate 0.406, rank 4): 0.76,59.18 24.32,59.18 24.32,19.43 113.67,19.43 113.67,59.05 125.6,59.18 125.6,0.76 0.76,0.89
  pour Top: 13.41,25.4 19.71,25.4 19.71,21.13 16.87,21.13 16.87,23.77 13.41,23.77
WHAT
  Top 0.305: IC3.24 54.59,34.21 54.46,34.34 53.44,34.34 52.02,32.92 51.41,32.92 JP6.1
X_EN  (via drill 0.33)
  Top 0.305: IC5.26 29.3,12.31 28.42,11.43 v28.26,11.43 | IC3.22 45.17,34.61 44.3,33.73 44.3,31.7 42.47,29.87 35.76,29.87 35.24,29.35 v35.24,29.27
  Inner 2 0.305: v35.24,29.27 33.66,27.69 33.66,19.37 34.61,18.41 34.61,17.46 33.97,16.83 30.48,16.83 27.62,13.97 27.62,12.06 v28.26,11.43
X_STOP  (via drill 0.3)
  Top 0.305: CON7.4 111,36.93 v110.74,37.19 | v84.73,31.7 73.56,31.7 71.93,30.07 63.2,30.07 61.16,28.04 54.46,28.04 53.78,28.71 IC3.23
  Bottom 0.305: v110.74,37.19 103.02,37.19 100.79,39.42 92.46,39.42 v84.73,31.7
XDIR  (via drill 0.33)
  Top 0.305: IC5.3 37.06,12.31 v37.94,11.43 | v50.16,35.43 50.8,35.43 50.83,35.41 IC3.21
  Inner 2 0.305: v37.94,11.43 36.51,12.86 36.51,22.9 45.31,31.7 45.31,32.51 48.16,35.36 50.09,35.36 v50.16,35.43
XSTEP  (via drill 0.33)
  Top 0.305: IC5.19 28.61,16.86 v28.57,16.83 | IC3.16 48.96,39.41 48.95,39.42 46.94,39.42 45.92,38.41 45.92,36.98 43.48,34.54 43.48,31.9 42.27,30.68 34.95,30.68 34.37,30.1 v34.29,30.1
  Inner 2 0.305: v34.29,30.1 31.43,27.24 31.43,19.68 v28.57,16.83
Y_EN  (via drill 0.33)
  Top 0.305: IC6.26 47.08,12.31 46.2,11.43 v46.04,11.43 | IC3.30 59.38,34.47 59.37,34.48 v59.37,34.8
  Inner 2 0.305: v59.37,34.8 58.74,34.8 57.47,33.53 55.88,33.53 52.43,30.07 52.43,26.71 51.61,25.89 51.57,25.85 51.44,25.72 51.44,19.05 52.07,18.41 52.07,17.46 51.44,16.83 47.94,16.83 45.4,14.29 45.4,12.06 v46.04,11.43
Y_STOP  (via drill 0.3)
  Top 0.305: CON6.4 111,38.86 v110.74,38.61 | IC3.31 60.19,31.46 60.76,30.89 71.73,30.89 73.36,32.51 v83.92,32.51
  Bottom 0.305: v110.74,38.61 102.82,38.61 100.99,40.44 91.85,40.44 v83.92,32.51
YDIR  (via drill 0.33)
  Top 0.305: 55.56,11.43 | 55.56,11.43 v55.72,11.43 54.84,12.31 IC6.3 | IC3.25 55.38,31.76 v54.93,31.3
  Inner 2 0.305: v55.72,11.43 54.29,12.86 54.29,22.81 55.88,24.4 55.88,29.67 54.93,30.62 v54.93,31.3
YSTEP  (via drill 0.33)
  Top 0.305: IC3.26 56.19,34.17 v55.56,34.8
  Top 0.406: IC6.19 46.39,16.86 v46.28,16.75
  Inner 2 0.305: v46.28,16.75 49.21,19.68 49.21,25.23 51.41,27.43 51.41,30.28 54.86,33.73 54.86,34.1 v55.56,34.8
Z_EN  (via drill 0.33)
  Top 0.305: IC7.26 64.86,12.31 63.98,11.43 v63.82,11.43 | IC3.35 61.57,35.41 v61.59,35.43
  Inner 2 0.305: v61.59,35.43 62.55,34.48 62.55,30.72 62.79,30.48 62.99,30.48 68.68,24.79 68.68,19.91 69.22,19.38 69.22,19.05 69.85,18.41 69.85,17.78 68.9,16.83 65.72,16.83 63.18,14.29 63.18,12.06 v63.82,11.43
Z_STOP  (via drill 0.3)
  Top 0.305: CON4.4 111,45.36 v110.74,45.11 | v82.5,34.95 75.59,34.95 73.36,37.19 68.48,37.19 67.06,38.61 66.45,39.22 66.26,39.41 IC3.40
  Bottom 0.305: v110.74,45.11 103.83,45.11 100.99,42.27 90.42,42.27 83.11,34.95 v82.5,34.95
ZDIR  (via drill 0.33)
  Top 0.305: IC7.3 72.62,12.31 v73.5,11.43 | IC3.34 63.59,34.57 63.5,34.48 v63.5,32.89
  Inner 2 0.305: v73.5,11.43 72.07,12.86 72.07,24.32 v63.5,32.89
ZSTEP  (via drill 0.33)
  Top 0.305: IC7.19 64.17,16.86 v64.06,16.75 | 61.78,32.77 IC3.33 61.78,33.97 v61.28,34.48
  Inner 2 0.305: v64.06,16.75 66.99,19.68 66.99,23.43 61.77,28.65 61.77,33.98 v61.28,34.48

### Text on the board
tPlace: zstop | ystop | xstop | fan | therm2 | Motors: | 1. A+ | 2. A- | heat2 | 3. B+ | 4. B- | Supply: | 12...24Vdc | - | + | heat1 | therm1 | xmotor | ymotor | zmotor | extrude
tNames: OK-PCB-0021-A3 | 3.3V | 5V | + | V+
bNames: modified from original gen6 design by eje electronics | gen6.d by http://romscraj.com